# EAGLE design Mega_PCB (EAGLE 9.6.2)
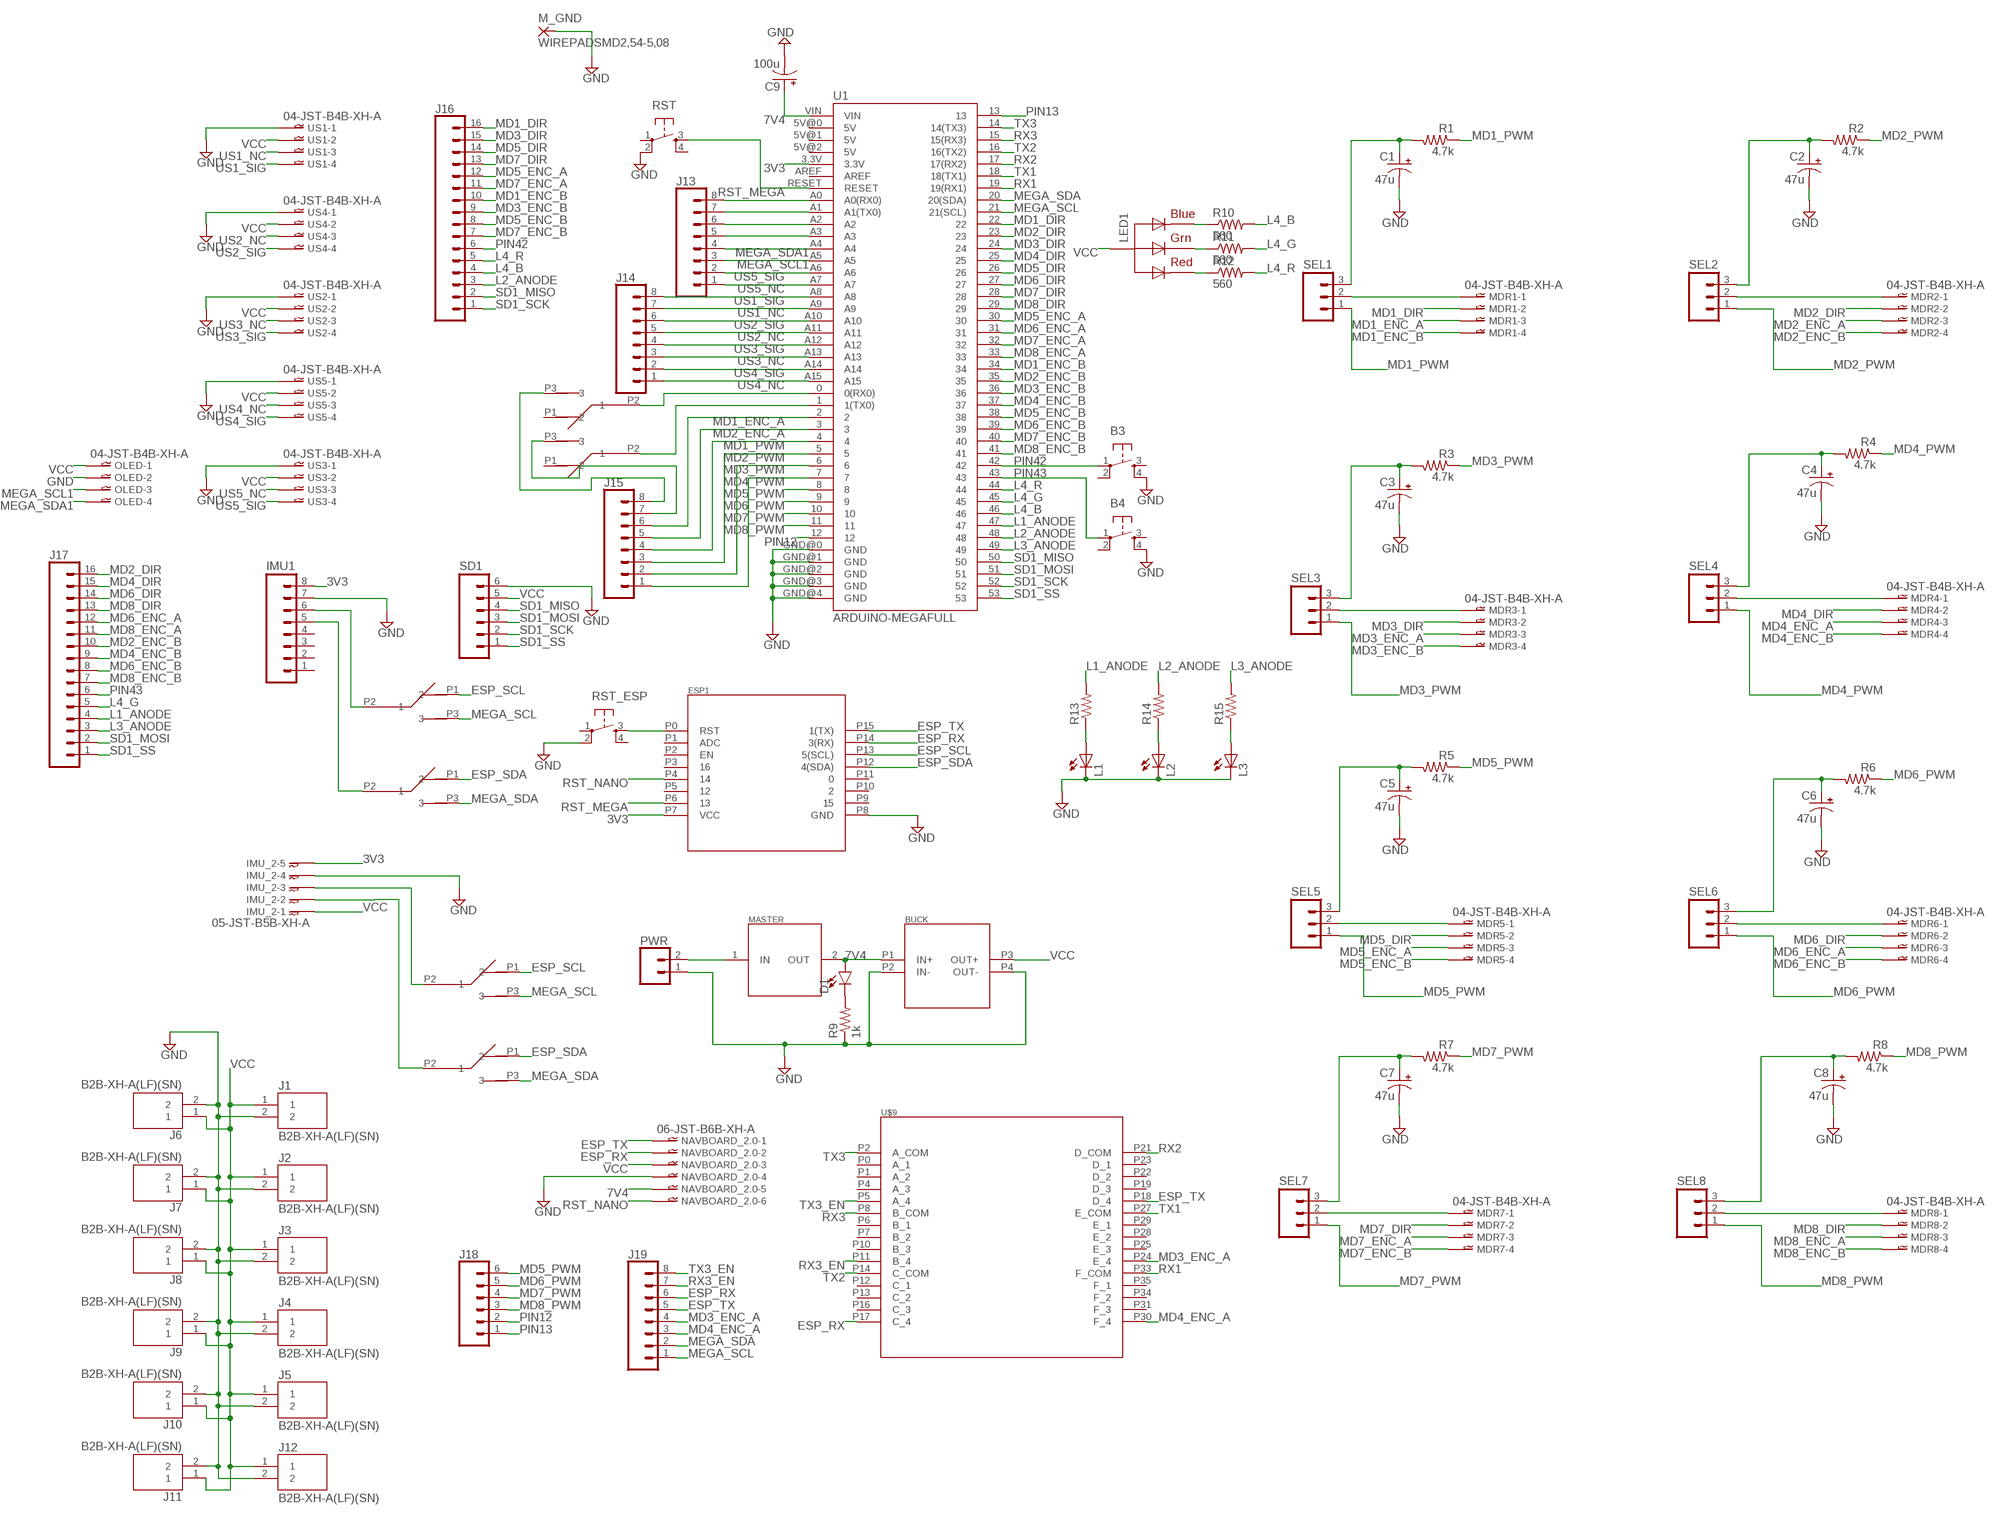
[diagram p0: schematic, sheet 1]

## Parts
B3  TAC_SWITCHPTH  [TACTILE-PTH]
B4  TAC_SWITCHPTH  [TACTILE-PTH]
BUCK  5V_BUCK  [5V_BUCK]
C1  47u  CPOL-USE2-5  [E2-5]
C2  47u  CPOL-USE2-5  [E2-5]
C3  47u  CPOL-USE2-5  [E2-5]
C4  47u  CPOL-USE2-5  [E2-5]
C5  47u  CPOL-USE2-5  [E2-5]
C6  47u  CPOL-USE2-5  [E2-5]
C7  47u  CPOL-USE2-5  [E2-5]
C8  47u  CPOL-USE2-5  [E2-5]
C9  100u  CPOL-USTT2D6  [TT2D6]
D1  LED5MM  [LED_5MM]
ESP1  ESP07  [ESP07]
IMU1  M081X08  [1X08]
IMU1_SCL_SEL  SLIDE_SWITCH  [SLIDE_SWITCH]
IMU1_SDA_SEL  SLIDE_SWITCH  [SLIDE_SWITCH]
IMU2_SCL_SEL  SLIDE_SWITCH  [SLIDE_SWITCH]
IMU2_SDA_SEL  SLIDE_SWITCH  [SLIDE_SWITCH]
IMU_2  05-JST-B5B-XH-A  [B5B-XH]
J1  B2B-XH-A(LF)(SN)  [JST_B2B-XH-A(LF)(SN)]
J2  B2B-XH-A(LF)(SN)  [JST_B2B-XH-A(LF)(SN)]
J3  B2B-XH-A(LF)(SN)  [JST_B2B-XH-A(LF)(SN)]
J4  B2B-XH-A(LF)(SN)  [JST_B2B-XH-A(LF)(SN)]
J5  B2B-XH-A(LF)(SN)  [JST_B2B-XH-A(LF)(SN)]
J6  B2B-XH-A(LF)(SN)  [JST_B2B-XH-A(LF)(SN)]
J7  B2B-XH-A(LF)(SN)  [JST_B2B-XH-A(LF)(SN)]
J8  B2B-XH-A(LF)(SN)  [JST_B2B-XH-A(LF)(SN)]
J9  B2B-XH-A(LF)(SN)  [JST_B2B-XH-A(LF)(SN)]
J10  B2B-XH-A(LF)(SN)  [JST_B2B-XH-A(LF)(SN)]
J11  B2B-XH-A(LF)(SN)  [JST_B2B-XH-A(LF)(SN)]
J12  B2B-XH-A(LF)(SN)  [JST_B2B-XH-A(LF)(SN)]
J13  CONN_08"  [1X08]
J14  CONN_08"  [1X08]
J15  CONN_08"  [1X08]
J16  CONN_16  [1X16]
J17  CONN_16  [1X16]
J18  CONN_06SILK_FEMALE_PTH  [1X06]
J19  CONN_08"  [1X08]
L1  LED3MM  [LED3MM]
L2  LED3MM  [LED3MM]
L3  LED3MM  [LED3MM]
LED1  RGBLED_CA-5MM  [LED5MMRGB]
M_GND  WIREPADSMD2,54-5,08  [SMD2,54-5,08]
MASTER  MED_SWITCH  [MED_SWITCH]
MDR1  04-JST-B4B-XH-A  [B4B-XH]
MDR2  04-JST-B4B-XH-A  [B4B-XH]
MDR3  04-JST-B4B-XH-A  [B4B-XH]
MDR4  04-JST-B4B-XH-A  [B4B-XH]
MDR5  04-JST-B4B-XH-A  [B4B-XH]
MDR6  04-JST-B4B-XH-A  [B4B-XH]
MDR7  04-JST-B4B-XH-A  [B4B-XH]
MDR8  04-JST-B4B-XH-A  [B4B-XH]
NAVBOARD_2.0  06-JST-B6B-XH-A  [B6B-XH]
OLED  04-JST-B4B-XH-A  [B4B-XH]
PWR  CONN_02PTH4  [1X02_XTRA_BIG]
R1  4.7k  R-US_0204/7  [0204/7]
R2  4.7k  R-US_0204/7  [0204/7]
R3  4.7k  R-US_0204/7  [0204/7]
R4  4.7k  R-US_0204/7  [0204/7]
R5  4.7k  R-US_0204/7  [0204/7]
R6  4.7k  R-US_0204/7  [0204/7]
R7  4.7k  R-US_0204/7  [0204/7]
R8  4.7k  R-US_0204/7  [0204/7]
R9  1k  R-US_0204/7  [0204/7]
R10  560  R-US_0204/7  [0204/7]
R11  560  R-US_0204/7  [0204/7]
R12  560  R-US_0204/7  [0204/7]
R13  R-US_0204/7  [0204/7]
R14  R-US_0204/7  [0204/7]
R15  R-US_0204/7  [0204/7]
RST  TAC_SWITCHPTH  [TACTILE-PTH]
RST_ESP  TAC_SWITCHPTH  [TACTILE-PTH]
SD1  M06SIP  [1X06]
SEL1  M03PTH  [1X03]
SEL2  M03PTH  [1X03]
SEL3  M03PTH  [1X03]
SEL4  M03PTH  [1X03]
SEL5  M03PTH  [1X03]
SEL6  M03PTH  [1X03]
SEL7  M03PTH  [1X03]
SEL8  M03PTH  [1X03]
U1  ARDUINO-MEGAFULL  [ARDUINO_MEGA]
U$3  SLIDE_SWITCH  [SLIDE_SWITCH]
U$4  SLIDE_SWITCH  [SLIDE_SWITCH]
U$9  CATERPILLAR  [CATERPILLAR]
US1  04-JST-B4B-XH-A  [B4B-XH]
US2  04-JST-B4B-XH-A  [B4B-XH]
US3  04-JST-B4B-XH-A  [B4B-XH]
US4  04-JST-B4B-XH-A  [B4B-XH]
US5  04-JST-B4B-XH-A  [B4B-XH]

## Nets
3V3: ESP1.P7(VCC) IMU1.8 IMU_2.P$5 U1.3.3V
7V4: BUCK.P1(IN+) C9.+ D1.A MASTER.2(OUT) NAVBOARD_2.0.P$5 U1.VIN
ESP_RX: ESP1.P14(3(RX)) J19.6 NAVBOARD_2.0.P$2 U$9.P17(C_4)
ESP_SCL: ESP1.P13(5(SCL)) IMU1_SCL_SEL.P1 IMU2_SCL_SEL.P1
ESP_SDA: ESP1.P12(4(SDA)) IMU1_SDA_SEL.P1 IMU2_SDA_SEL.P1
ESP_TX: ESP1.P15(1(TX)) J19.5 NAVBOARD_2.0.P$1 U$9.P18(D_4)
GND: B3.4 B4.4 BUCK.P2(IN-) BUCK.P4(OUT-) C1.- C2.- C3.- C4.- C5.- C6.- C7.- C8.- C9.- ESP1.P8(GND) IMU1.7 IMU_2.P$4 J1.2 J2.2 J3.2 J4.2 J5.2 J6.2 J7.2 J8.2 J9.2 J10.2 J11.2 J12.2 L1.K(C) L2.K(C) L3.K(C) M_GND.1(P) NAVBOARD_2.0.P$4 OLED.P$2 PWR.1 R9.1 RST.2 RST_ESP.2 SD1.6 U1.GND@0(GND) U1.GND@1(GND) U1.GND@2(GND) U1.GND@3(GND) U1.GND@4(GND) US1.P$1 US2.P$1 US3.P$1 US4.P$1 US5.P$1
IMU_SDA: IMU1.5 IMU1_SDA_SEL.P2
IMU_SDA1: IMU2_SDA_SEL.P2 IMU_2.P$2
L1_ANODE: J17.4 R13.2 U1.47
L2_ANODE: J16.3 R14.2 U1.48
L3_ANODE: J17.3 R15.2 U1.49
L4_B: J16.4 R10.2 U1.46
L4_G: J17.5 R11.2 U1.45
L4_R: J16.5 R12.2 U1.44
MD1_DIR: J16.16 MDR1.P$2 U1.22
MD1_ENC_A: J15.6 MDR1.P$3 U1.2
MD1_ENC_B: J16.10 MDR1.P$4 U1.34
MD1_PWM: J15.4 R1.1 SEL1.1 U1.4
MD2_DIR: J17.16 MDR2.P$2 U1.23
MD2_ENC_A: J15.5 MDR2.P$3 U1.3
MD2_ENC_B: J17.10 MDR2.P$4 U1.35
MD2_PWM: J15.3 R2.1 SEL2.1 U1.5
MD3_DIR: J16.15 MDR3.P$2 U1.24
MD3_ENC_A: J19.4 MDR3.P$3 U$9.P24(E_4)
MD3_ENC_B: J16.9 MDR3.P$4 U1.36
MD3_PWM: J15.2 R3.1 SEL3.1 U1.6
MD4_DIR: J17.15 MDR4.P$2 U1.25
MD4_ENC_A: J19.3 MDR4.P$3 U$9.P30(F_4)
MD4_ENC_B: J17.9 MDR4.P$4 U1.37
MD4_PWM: J15.1 R4.1 SEL4.1 U1.7
MD5_DIR: J16.14 MDR5.P$2 U1.26
MD5_ENC_A: J16.12 MDR5.P$3 U1.30
MD5_ENC_B: J16.8 MDR5.P$4 U1.38
MD5_PWM: J18.6 R5.1 SEL5.1 U1.8
MD6_DIR: J17.14 MDR6.P$2 U1.27
MD6_ENC_A: J17.12 MDR6.P$3 U1.31
MD6_ENC_B: J17.8 MDR6.P$4 U1.39
MD6_PWM: J18.5 R6.1 SEL6.1 U1.9
MD7_DIR: J16.13 MDR7.P$2 U1.28
MD7_ENC_A: J16.11 MDR7.P$3 U1.32
MD7_ENC_B: J16.7 MDR7.P$4 U1.40
MD7_PWM: J18.4 R7.1 SEL7.1 U1.10
MD8_DIR: J17.13 MDR8.P$2 U1.29
MD8_ENC_A: J17.11 MDR8.P$3 U1.33
MD8_ENC_B: J17.7 MDR8.P$4 U1.41
MD8_PWM: J18.3 R8.1 SEL8.1 U1.11
MEGA_SCL: IMU1_SCL_SEL.P3 IMU2_SCL_SEL.P3 J19.1 U1.21(21(SCL))
MEGA_SCL1: J13.3 OLED.P$3 U1.A5
MEGA_SDA: IMU1_SDA_SEL.P3 IMU2_SDA_SEL.P3 J19.2 U1.20(20(SDA))
MEGA_SDA1: J13.4 OLED.P$4 U1.A4
N$0: MDR2.P$1 SEL2.2
N$1: C2.+ R2.2 SEL2.3
N$2: MDR3.P$1 SEL3.2
N$3: MDR1.P$1 SEL1.2
N$4: C3.+ R3.2 SEL3.3
N$5: C4.+ R4.2 SEL4.3
N$6: C8.+ R8.2 SEL8.3
N$7: C6.+ R6.2 SEL6.3
N$8: MDR4.P$1 SEL4.2
N$9: MDR8.P$1 SEL8.2
N$10: C5.+ R5.2 SEL5.3
N$11: IMU1.6 IMU1_SCL_SEL.P2
N$12: D1.K(C) R9.2
N$13: LED1.4(BLUE) R10.1
N$14: J13.8 U1.A0(A0(RX0))
N$15: C1.+ R1.2 SEL1.3
N$16: MDR5.P$1 SEL5.2
N$17: MDR6.P$1 SEL6.2
N$18: U1.0(0(RX0)) U$3.P2
N$19: U1.1(1(TX0)) U$4.P2
N$20: IMU2_SCL_SEL.P2 IMU_2.P$3
N$21: C7.+ R7.2 SEL7.3
N$22: MDR7.P$1 SEL7.2
N$23: J13.7 U1.A1(A1(TX0))
N$24: ESP1.P0(RST) RST_ESP.3
N$25: J13.6 U1.A2
N$26: J13.5 U1.A3
N$29: J15.8 U$3.P3
N$30: J15.7 U$4.P3
N$31: LED1.3(GREEN) R11.1
N$32: LED1.1(RED) R12.1
N$36: L1.A R13.1
N$37: L2.A R14.1
N$38: L3.A R15.1
N&N: MASTER.1(IN) PWR.2
PIN12: J18.2 U1.12
PIN13: J18.1 U1.13
PIN42: B3.1 J16.6 U1.42
PIN43: B4.1 J17.6 U1.43
RST_MEGA: ESP1.P6 RST.3 U1.RESET
RST_NANO: ESP1.P4 NAVBOARD_2.0.P$6
RX1: U1.19(19(RX1)) U$9.P33(F_COM)
RX2: U1.17(17(RX2)) U$9.P21(D_COM)
RX3: U1.15(15(RX3)) U$9.P8(B_COM)
RX3_EN: J19.7 U$9.P11(B_4)
SD1_MISO: J16.2 SD1.4 U1.50
SD1_MOSI: J17.2 SD1.3 U1.51
SD1_SCK: J16.1 SD1.2 U1.52
SD1_SS: J17.1 SD1.1 U1.53
TX1: U1.18(18(TX1)) U$9.P27(E_COM)
TX2: U1.16(16(TX2)) U$9.P14(C_COM)
TX3: U1.14(14(TX3)) U$9.P2(A_COM)
TX3_EN: J19.8 U$9.P5(A_4)
US1_NC: J14.7 U1.A9 US1.P$3
US1_SIG: J14.8 U1.A8 US1.P$4
US2_NC: J14.5 U1.A11 US4.P$3
US2_SIG: J14.6 U1.A10 US4.P$4
US3_NC: J14.3 U1.A13 US2.P$3
US3_SIG: J14.4 U1.A12 US2.P$4
US4_NC: J14.1 U1.A15 US5.P$3
US4_SIG: J14.2 U1.A14 US5.P$4
US5_NC: J13.1 U1.A7 US3.P$3
US5_SIG: J13.2 U1.A6 US3.P$4
VCC: BUCK.P3(OUT+) IMU_2.P$1 J1.1 J2.1 J3.1 J4.1 J5.1 J6.1 J7.1 J8.1 J9.1 J10.1 J11.1 J12.1 LED1.2(VCC) NAVBOARD_2.0.P$3 OLED.P$1 SD1.5 US1.P$2 US2.P$2 US3.P$2 US4.P$2 US5.P$2
Unconnected: B3.2 B3.3 B4.2 B4.3 ESP1.P1(ADC) ESP1.P2(EN) ESP1.P3 ESP1.P5 ESP1.P9 ESP1.P10 ESP1.P11 IMU1.1 IMU1.2 IMU1.3 IMU1.4 RST.1 RST.4 RST_ESP.1 RST_ESP.4 U1.5V@0(5V) U1.5V@1(5V) U1.5V@2(5V) U1.AREF U$3.P1 U$4.P1 U$9.P0(A_1) U$9.P1(A_2) U$9.P4(A_3) U$9.P6(B_1) U$9.P7(B_2) U$9.P10(B_3) U$9.P12(C_1) U$9.P13(C_2) U$9.P16(C_3) U$9.P19(D_3) U$9.P22(D_2) U$9.P23(D_1) U$9.P25(E_3) U$9.P28(E_2) U$9.P29(E_1) U$9.P31(F_3) U$9.P34(F_2) U$9.P35(F_1)

## Library data of the parts
B3 B4 RST RST_ESP = SparkFun:TAC_SWITCH: Momentary Switch Button commonly used for reset or general input. Spark Fun Electronics SKU : COM-00097
BUCK = Robocon:5V_BUCK
C1-C9 = adafruit:CPOL-US: POLARIZED CAPACITOR, American symbol
D1 = SparkFun-LED:LED: LED (Generic) Standard schematic elements and footprints for 5mm, 3mm, 1206, and 0603 sized LEDs. Generic LEDs with no color specified.
ESP1 = Robocon:ESP07
IMU1 = SparkFun:M08: Header 8 Standard 8-pin 0.1" header. Use with straight break away headers (SKU : PRT-00116), right angle break away headers (PRT-00553), swiss pins (PRT-00743), machine pins (PRT-00117), and female headers (PRT-00115).
IMU1_SCL_SEL IMU1_SDA_SEL IMU2_SCL_SEL IMU2_SDA_SEL U$3 U$4 = Robocon:SLIDE_SWITCH
IMU_2 = bt_con-jst-xh:05-JST: JST CONNECTOR
J1-J12 = B2B-XH-A_LF__SN_:B2B-XH-A(LF)(SN): Connector Header Through Hole 2 position 0.098" (2.50mm) Check prices <https://pricing.snapeda.com/parts/B2B-XH-A%28LF%29%28SN%29/JST%20Sales/view-part?ref=eda> Check availability <https://pricing.snapeda.com/parts/B2B-XH-A%28LF%29%28SN%29/JST%20Sales/view-part?ref=eda>; AVAILABILITY: In Stock; DESCRIPTION: Connector Header Through Hole 2 position 0.098 (2.50mm); MF: JST Sales; MP: B2B-XH-A(LF)(SN); PACKAGE: None; PRICE: None; PURCHASE-URL: https://pricing.snapeda.com/search/part/B2B-XH-A(LF)(SN)/?ref=eda
J13-J15 J19 = SparkFun-Connectors:CONN_08: Multi connection point. Often used as Generic Header-pin footprint for 0.1 inch spaced/style header connections On any of the 0.1 inch spaced packages, you can populate with these: Break Away Headers - Straight <https://www.sparkfun.com/products/116> (PRT-00116) Break Away Male Headers - Right Angle <https://www.sparkfun.com/products/553> (PRT-00553) Female Headers <https://www.sparkfun.com/products/115> (PRT-00115) Break Away Headers - Machine Pin <https://www.sparkfun.com/products/117> (PRT-00117) Break Away Female Headers - Swiss Machine Pin <https://www.sparkfun.com/products/743> (PRT-00743) Arduino Stackable Header - 8 Pin <https://www.sparkfun.com/products/9279> (PRT-09279) For SCREWTERMINALS and SPRING TERMINALS visit here: Screw Terimnals on SparkFun.com <https://www.sparkfun.com/search/results?term=Screw+Terminals> (5mm/3.5mm/2.54mm spacing) This device is also useful as a general connection point to wire up your design to another part of your project. Our various solder wires solder well into these plated through hole pads. Hook-Up Wire - Assortment (Stranded, 22 AWG) <https://www.sparkfun.com/products/11375> (PRT-11375) Hook-Up Wire - Assortment (Solid Core, 22 AWG) <https://www.sparkfun.com/products/11367> (PRT-11367) View the entire wire category on our website here <https://www.sparkfun.com/categories/141> Special notes: Molex polarized connector foot print use with SKU : PRT-08231 with associated crimp pins and housings. 1MM SMD Version SKU: PRT-10208 NOTES ON THE VARIANTS LOCK and LOCK_LONGPADS... This footprint was designed to help hold the alignment of a through-hole component (i.e. 6-pin header) while soldering it into place. You may notice that each hole has been shifted either up or down by 0.005 of an inch from it's more standard position (which is a perfectly straight line). This slight alteration caused the pins (the squares in the middle) to touch the edges of the holes. Because they are alternating, it causes a "brace" to hold the component in place. 0.005 has proven to be the perfect amount of "off-center" position when using our standard breakaway headers. Although looks a little odd when you look at the bare footprint, once you have a header in there, the alteration is very hard to notice. Also,if you push a header all the way into place, it is covered up entirely on the bottom side.; PROD_ID: CONN-08438
J16 J17 = SparkFun-Connectors:CONN_16: Multi connection point. Often used as Generic Header-pin footprint for 0.1 inch spaced/style header connections On any of the 0.1 inch spaced packages, you can populate with these: Break Away Headers - Straight <https://www.sparkfun.com/products/116> (PRT-00116) Break Away Male Headers - Right Angle <https://www.sparkfun.com/products/553> (PRT-00553) Female Headers <https://www.sparkfun.com/products/115> (PRT-00115) Break Away Headers - Machine Pin <https://www.sparkfun.com/products/117> (PRT-00117) Break Away Female Headers - Swiss Machine Pin <https://www.sparkfun.com/products/743> (PRT-00743) For SCREWTERMINALS and SPRING TERMINALS visit here: Screw Terimnals on SparkFun.com <https://www.sparkfun.com/search/results?term=Screw+Terminals> (5mm/3.5mm/2.54mm spacing) This device is also useful as a general connection point to wire up your design to another part of your project. Our various solder wires solder well into these plated through hole pads. Hook-Up Wire - Assortment (Stranded, 22 AWG) <https://www.sparkfun.com/products/11375> (PRT-11375) Hook-Up Wire - Assortment (Solid Core, 22 AWG) <https://www.sparkfun.com/products/11367> (PRT-11367) View the entire wire category on our website here <https://www.sparkfun.com/categories/141> Special notes: Molex polarized connector foot print use with SKU : PRT-08231 with associated crimp pins and housings. 1MM SMD Version SKU: PRT-10208 NOTES ON THE VARIANTS LOCK and LOCK_LONGPADS... This footprint was designed to help hold the alignment of a through-hole component (i.e. 6-pin header) while soldering it into place. You may notice that each hole has been shifted either up or down by 0.005 of an inch from it's more standard position (which is a perfectly straight line). This slight alteration caused the pins (the squares in the middle) to touch the edges of the holes. Because they are alternating, it causes a "brace" to hold the component in place. 0.005 has proven to be the perfect amount of "off-center" position when using our standard breakaway headers. Although looks a little odd when you look at the bare footprint, once you have a header in there, the alteration is very hard to notice. Also,if you push a header all the way into place, it is covered up entirely on the bottom side.
J18 = SparkFun-Connectors:CONN_06: Multi connection point. Often used as Generic Header-pin footprint for 0.1 inch spaced/style header connections On any of the 0.1 inch spaced packages, you can populate with these: Break Away Headers - Straight <https://www.sparkfun.com/products/116> (PRT-00116) Break Away Male Headers - Right Angle <https://www.sparkfun.com/products/553> (PRT-00553) Female Headers <https://www.sparkfun.com/products/115> (PRT-00115) Break Away Headers - Machine Pin <https://www.sparkfun.com/products/117> (PRT-00117) Break Away Female Headers - Swiss Machine Pin <https://www.sparkfun.com/products/743> (PRT-00743) Arduino Stackable Header - 6 Pin <https://www.sparkfun.com/products/9280> (PRT-09280) For SCREWTERMINALS and SPRING TERMINALS visit here: Screw Terimnals on SparkFun.com <https://www.sparkfun.com/search/results?term=Screw+Terminals> (5mm/3.5mm/2.54mm spacing) This device is also useful as a general connection point to wire up your design to another part of your project. Our various solder wires solder well into these plated through hole pads. Hook-Up Wire - Assortment (Stranded, 22 AWG) <https://www.sparkfun.com/products/11375> (PRT-11375) Hook-Up Wire - Assortment (Solid Core, 22 AWG) <https://www.sparkfun.com/products/11367> (PRT-11367) View the entire wire category on our website here <https://www.sparkfun.com/categories/141>; PROD_ID: CONN-08437
L1-L3 = adafruit:LED: LED OSRAM: - CHIPLED LG R971, LG N971, LY N971, LG Q971, LY Q971, LO R971, LY R971 LH N974, LH R974 LS Q976, LO Q976, LY Q976 LO Q996 - Hyper CHIPLED LW Q18S LB Q993, LB Q99A, LB R99A - SideLED LS A670, LO A670, LY A670, LG A670, LP A670 LB A673, LV A673, LT A673, LW A673 LH A674 LY A675 LS A676, LA A676, LO A676, LY A676, LW A676 LS A679, LY A679, LG A679 - Hyper Micro SIDELED® LS Y876, LA Y876, LO Y876, LY Y876 LT Y87S - SmartLED LW L88C, LW L88S LB L89C, LB L89S, LG L890 LS L89K, LO L89K, LY L89K LS L896, LA L896, LO L896, LY L896 - TOPLED LS T670, LO T670, LY T670, LG T670, LP T670 LSG T670, LSP T670, LSY T670, LOP T670, LYG T670 LG T671, LOG T671, LSG T671 LB T673, LV T673, LT T673, LW T673 LH T674 LS T676, LA T676, LO T676, LY T676, LB T676, LH T676, LSB T676, LW T676 LB T67C, LV T67C, LT T67C, LS T67K, LO T67K, LY T67K, LW E67C LS E67B, LA E67B, LO E67B, LY E67B, LB E67C, LV E67C, LT E67C LW T67C LS T679, LY T679, LG T679 LS T770, LO T770, LY T770, LG T770, LP T770 LB T773, LV T773, LT T773, LW T773 LH T774 LS E675, LA E675, LY E675, LS T675 LS T776, LA T776, LO T776, LY T776, LB T776 LHGB T686 LT T68C, LB T68C - Hyper Mini TOPLED® LB M676 - Mini TOPLED Santana® LG M470 LS M47K, LO M47K, LY M47K Source: http://www.osram.convergy.de/
LED1 = adafruit:RGBLED_CA: RGB LED, common-anode 5MM Staggered pins 5mm Piranha package http://www.ladyada.net/library/pcb/eaglelibrary.html
M_GND = wirepad:WIREPAD: Wire PAD connect wire on PCB
MASTER = Robocon:MED_SWITCH
MDR1-MDR8 OLED US1-US5 = bt_con-jst-xh:04-JST: JST CONNECTOR
NAVBOARD_2.0 = bt_con-jst-xh:06-JST: JST CONNECTOR
PWR = SparkFun-Connectors:CONN_02: Multi connection point. Often used as Generic Header-pin footprint for 0.1 inch spaced/style header connections On any of the 0.1 inch spaced packages, you can populate with these: Break Away Headers - Straight <https://www.sparkfun.com/products/116> (PRT-00116) Break Away Male Headers - Right Angle <https://www.sparkfun.com/products/553> (PRT-00553) Female Headers <https://www.sparkfun.com/products/115> (PRT-00115) Break Away Headers - Machine Pin <https://www.sparkfun.com/products/117> (PRT-00117) Break Away Female Headers - Swiss Machine Pin <https://www.sparkfun.com/products/743> (PRT-00743) For SCREWTERMINALS and SPRING TERMINALS visit here: Screw Terimnals on SparkFun.com <https://www.sparkfun.com/search/results?term=Screw+Terminals> (5mm/3.5mm/2.54mm spacing) This device is also useful as a general connection point to wire up your design to another part of your project. Our various solder wires solder well into these plated through hole pads. Hook-Up Wire - Assortment (Stranded, 22 AWG) <https://www.sparkfun.com/products/11375> (PRT-11375) Hook-Up Wire - Assortment (Solid Core, 22 AWG) <https://www.sparkfun.com/products/11367> (PRT-11367) View the entire wire category on our website here <https://www.sparkfun.com/categories/141> Special notes: Molex polarized connector foot print use with: PRT-08233 with associated crimp pins and housings. 2.54_SCREWTERM for use with PRT-10571. 3.5mm Screw Terminal footprints for PRT-08084 5mm Screw Terminal footprints for use with PRT-08432
R1-R15 = adafruit:R-US_: RESISTOR, American symbol
SD1 = SparkFun:M06: Header 6 Standard 6-pin 0.1" header. Use with straight break away headers (SKU : PRT-00116), right angle break away headers (PRT-00553), swiss pins (PRT-00743), machine pins (PRT-00117), and female headers (PRT-00115). Molex polarized connector foot print use with SKU : PRT-08094 with associated crimp pins and housings. NOTES ON THE VARIANTS LOCK and LOCK_LONGPADS... This footprint was designed to help hold the alignment of a through-hole component (i.e. 6-pin header) while soldering it into place. You may notice that each hole has been shifted either up or down by 0.005 of an inch from it's more standard position (which is a perfectly straight line). This slight alteration caused the pins (the squares in the middle) to touch the edges of the holes. Because they are alternating, it causes a "brace" to hold the component in place. 0.005 has proven to be the perfect amount of "off-center" position when using our standard breakaway headers. Although looks a little odd when you look at the bare footprint, once you have a header in there, the alteration is very hard to notice. Also, if you push a header all the way into place, it is covered up entirely on the bottom side. This idea of altering the position of holes to aid alignment will be further integrated into the Sparkfun Library for other footprints. It can help hold any component with 3 or more connection pins.
SEL1-SEL8 = SparkFun:M03: Header 3 Standard 3-pin 0.1" header. Use with straight break away headers (SKU : PRT-00116), right angle break away headers (PRT-00553), swiss pins (PRT-00743), machine pins (PRT-00117), and female headers (PRT-00115). Molex polarized connector foot print use with SKU : PRT-08232 with associated crimp pins and housings.
U1 = SparkFun:ARDUINO-MEGA: Arduino Mega footprint connections
U$9 = Robocon:CATERPILLAR

## Board
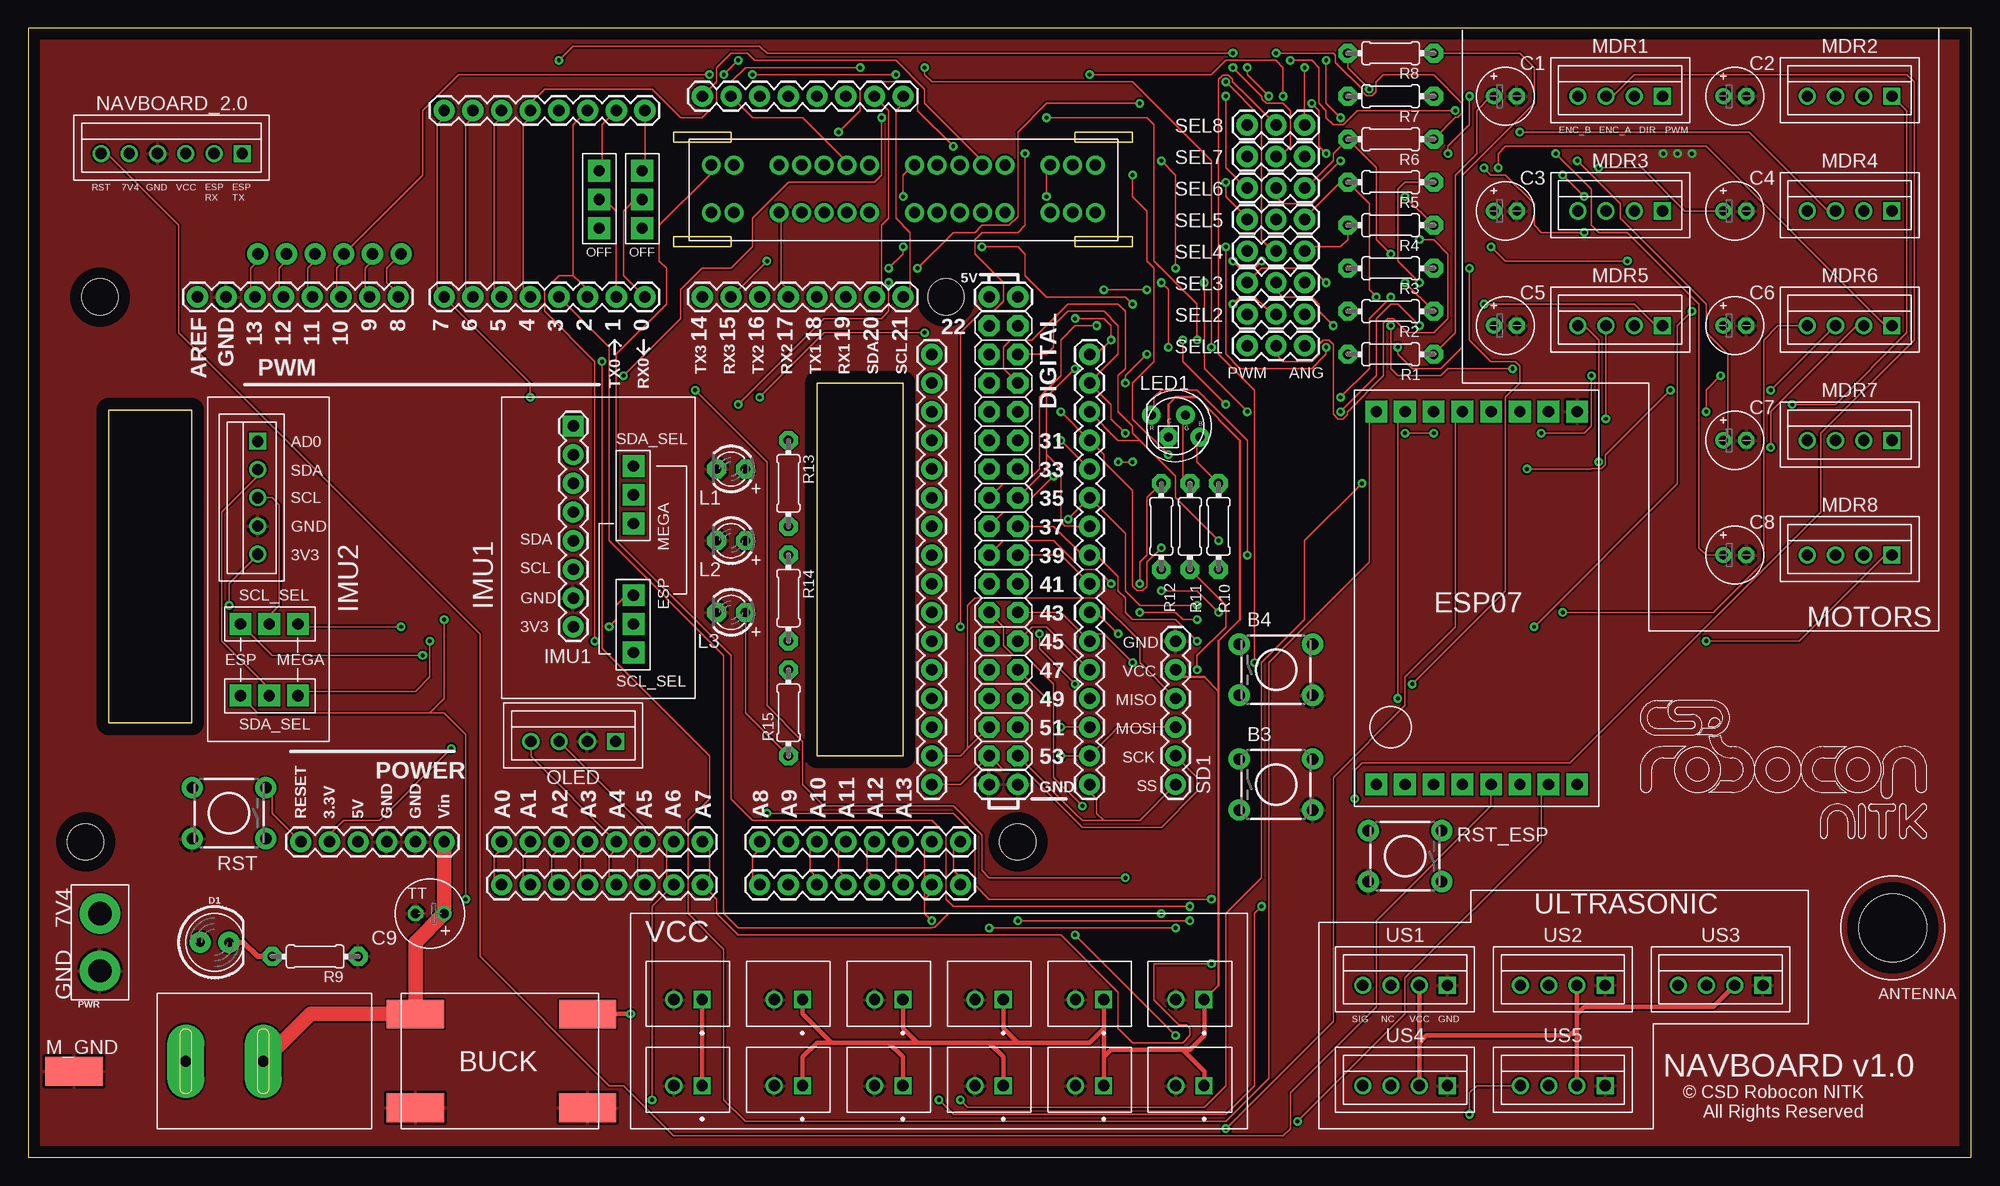
[diagram p1: board, top side]
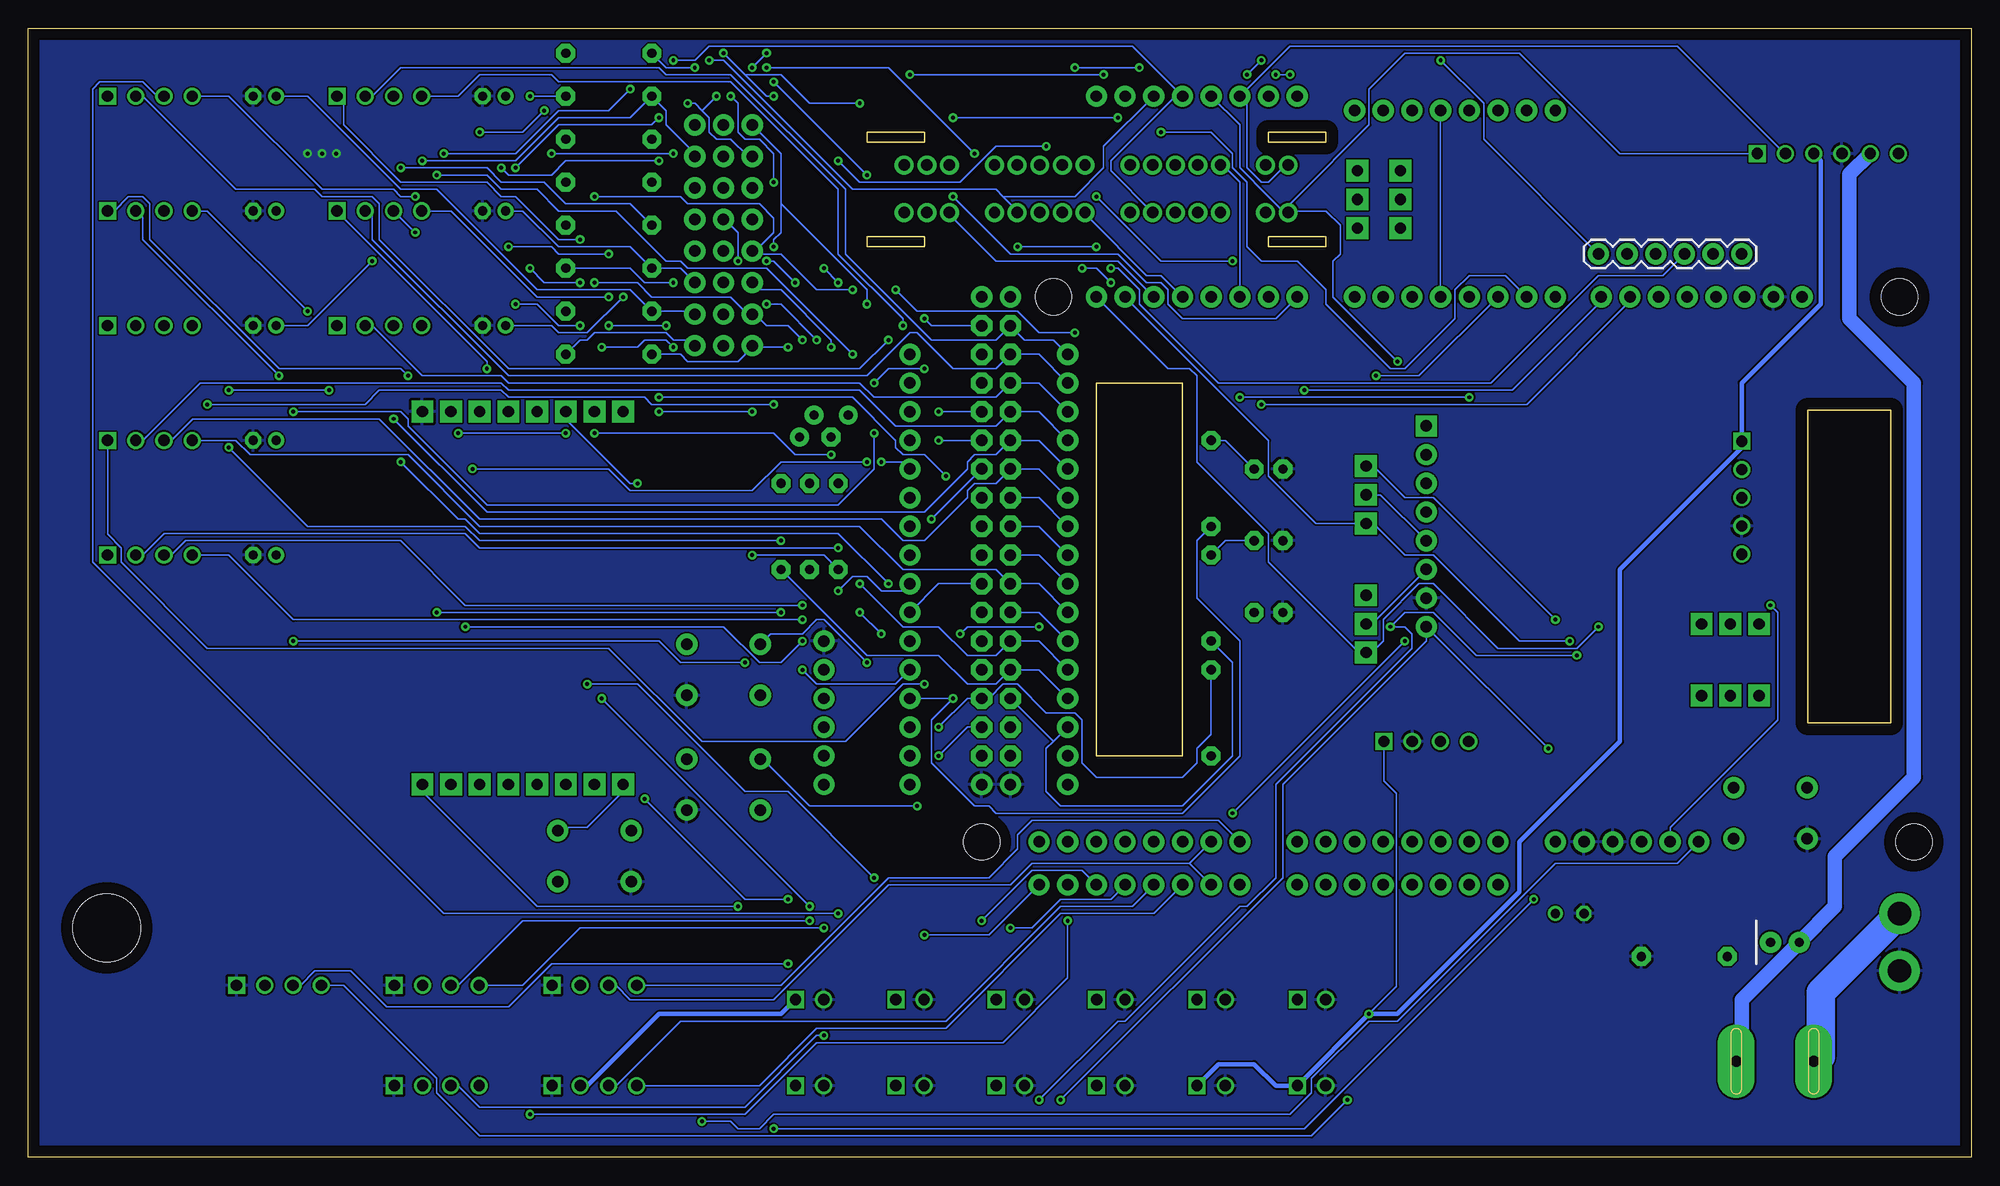
[diagram p2: board, bottom side, seen from below]

Size 172.06 x 100 mm. Coordinates in mm from the lower left corner, seen from the top.
Copper layers (1*16): Top 0.035mm / dielectric 1.5mm / Bottom 0.035mm
Design rules "default": minimum track width 6mil, minimum drill 0.35mm, track to track 6mil, track to pad 6mil, pad to pad 6mil, via to via 6mil, smd to smd 6mil, copper to edge 40mil, drill to drill 6mil, minimum pad ring 10mil, minimum via ring 8mil, stop-mask expansion 4mil, vias tented up to drill 0mil, thermal gap 10mil
Holes 6 mm at 165.1,20.32

### Footprints (pad centres in the part's own frame; a part is rotated, then mirrored left to right if it is on the bottom)
TACTILE-PTH = drill 1.016 pad 1.88: 1 -3.251,2.261; 2 3.251,2.261; 3 -3.251,-2.261; 4 3.251,-2.261
5V_BUCK = smd 5.08 x 2.54: P1 1.27,10.16; P2 1.27,1.84; P3 16.51,10.16; P4 16.51,1.84
E2-5 = drill 0.813 pad 1.422: + -1.016,0 | drill 0.813 pad 1.422 octagon: - 1.016,0
TT2D6 = drill 0.813: + -1.27,0 | drill 0.813 octagon: - 1.27,0
LED_5MM = drill 0.813 pad 1.88: A -1.27,0; K 1.27,0
ESP07 = drill 1 pad 1.93 square: P0 -16.51,8.89; P1 -16.51,6.35; P2 -16.51,3.81; P3 -16.51,1.27; P4 -16.51,-1.27; P5 -16.51,-3.81; P6 -16.51,-6.35; P7 -16.51,-8.89; P8 16.51,-8.89; P9 16.51,-6.35; P10 16.51,-3.81; P11 16.51,-1.27; P12 16.51,1.27; P13 16.51,3.81; P14 16.51,6.35; P15 16.51,8.89
1X08 = drill 1.016 pad 1.88 square: 1 0,0 | drill 1.016 pad 1.88: 2 2.54,0; 3 5.08,0; 4 7.62,0; 5 10.16,0; 6 12.7,0; 7 15.24,0; 8 17.78,0
SLIDE_SWITCH = drill 1 pad 1.93 square: P1 1.524,6.604; P2 1.524,4.064; P3 1.524,1.524
B5B-XH = drill 1 square: P$1 5,0 | drill 1: P$2 2.5,0; P$3 0,0; P$4 -2.5,0; P$5 -5,0
JST_B2B-XH-A(LF)(SN) = drill 1 square: 1 1.25,0 | drill 1: 2 -1.25,0
1X08' = drill 1.016 pad 1.88: 1 0,0; 2 2.54,0; 3 5.08,0; 4 7.62,0; 5 10.16,0; 6 12.7,0; 7 15.24,0; 8 17.78,0
1X16 = drill 1.016 pad 1.88: 1 0,0; 2 2.54,0; 3 5.08,0; 4 7.62,0; 5 10.16,0; 6 12.7,0; 7 15.24,0; 8 17.78,0; 9 20.32,0; 10 22.86,0; 11 25.4,0; 12 27.94,0; 13 30.48,0; 14 33.02,0; 15 35.56,0; 16 38.1,0
1X06 = drill 1.016 pad 1.88: 1 0,0; 2 2.54,0; 3 5.08,0; 4 7.62,0; 5 10.16,0; 6 12.7,0
LED3MM = drill 0.813 pad 1.676 octagon: A -1.27,0; K 1.27,0
LED5MMRGB = drill 0.8 pad 1.676: 1 -2.159,0.968; 3 0.889,0.968; 4 2.159,-0.968 | drill 0.8 pad 1.676 octagon: 2 -0.635,-0.968
SMD2,54-5,08 = smd 2.54 x 5.08: 1 0,0
MED_SWITCH = drill 0.98 pad 3.26 long: 1 2.525,5.969; 2 9.383,5.969
B4B-XH = drill 1 square: P$1 3.75,0 | drill 1: P$2 1.25,0; P$3 -1.25,0; P$4 -3.75,0
B6B-XH = drill 1 square: P$1 6.25,0 | drill 1: P$2 3.75,0; P$3 1.25,0; P$4 -1.25,0; P$5 -3.75,0; P$6 -6.25,0
1X02_XTRA_BIG = drill 2.057 pad 3.556: 1 -2.54,0; 2 2.54,0
0204/7 = drill 0.813 pad 1.676 octagon: 1 -3.81,0; 2 3.81,0
1X03 = drill 1.016 pad 1.88: 1 0,0; 2 2.54,0; 3 5.08,0
ARDUINO_MEGA = drill 1.016 pad 1.88: 0 54.61,76.2; 1 52.07,76.2; 2 49.53,76.2; 3 46.99,76.2; 3.3V 26.67,27.94; 4 44.45,76.2; 5 41.91,76.2; 5V@0 29.21,27.94; 5V@1 85.09,76.2; 5V@2 87.63,76.2; 6 39.37,76.2; 7 36.83,76.2; 8 32.766,76.2; 9 30.226,76.2; 10 27.686,76.2; 11 25.146,76.2; 12 22.606,76.2; 13 20.066,76.2; 14 59.69,76.2; 15 62.23,76.2; 16 64.77,76.2; 17 67.31,76.2; 18 69.85,76.2; 19 72.39,76.2; 20 74.93,76.2; 21 77.47,76.2; A0 41.91,27.94; A1 44.45,27.94; A2 46.99,27.94; A3 49.53,27.94; A4 52.07,27.94; A5 54.61,27.94; A6 57.15,27.94; A7 59.69,27.94; A8 64.77,27.94; A9 67.31,27.94; A10 69.85,27.94; A11 72.39,27.94; A12 74.93,27.94; A13 77.47,27.94; A14 80.01,27.94; A15 82.55,27.94; AREF 14.986,76.2; GND@0 31.75,27.94; GND@1 34.29,27.94; GND@2 85.09,33.02; GND@3 87.63,33.02; GND@4 17.526,76.2; RESET 24.13,27.94; VIN 36.83,27.94 | drill 1.016 pad 1.88 octagon: 22 85.09,73.66; 23 87.63,73.66; 24 85.09,71.12; 25 87.63,71.12; 26 85.09,68.58; 27 87.63,68.58; 28 85.09,66.04; 29 87.63,66.04; 30 85.09,63.5; 31 87.63,63.5; 32 85.09,60.96; 33 87.63,60.96; 34 85.09,58.42; 35 87.63,58.42; 36 85.09,55.88; 37 87.63,55.88; 38 85.09,53.34; 39 87.63,53.34; 40 85.09,50.8; 41 87.63,50.8; 42 85.09,48.26; 43 87.63,48.26; 44 85.09,45.72; 45 87.63,45.72; 46 85.09,43.18; 47 87.63,43.18; 48 85.09,40.64; 49 87.63,40.64; 50 85.09,38.1; 51 87.63,38.1; 52 85.09,35.56; 53 87.63,35.56 | hole 3.2: 6.35,76.2; 5.08,27.94; 81.28,76.2; 87.63,27.94
CATERPILLAR = drill 1 pad 1.676: P0 2.032,2.286; P1 4.032,2.286; P2 6.032,2.286; P4 10.032,2.286; P5 12.032,2.286; P6 14.032,2.286; P7 16.032,2.286; P8 18.032,2.286; P10 22.032,2.286; P11 24.032,2.286; P12 26.032,2.286; P13 28.032,2.286; P14 30.032,2.286; P16 34.032,2.286; P17 36.032,2.286; P18 36.032,6.486; P19 34.032,6.486; P21 30.032,6.486; P22 28.032,6.486; P23 26.032,6.486; P24 24.032,6.486; P25 22.032,6.486; P27 18.032,6.486; P28 16.032,6.486; P29 14.032,6.486; P30 12.032,6.486; P31 10.032,6.486; P33 6.032,6.486; P34 4.032,6.486; P35 2.032,6.486

### Placement (x,y rotation side)
B3  110.49,33.02 0 top
B4  110.49,43.18 0 top
BUCK  33.02,2.54 0 top
C1  130.81,93.98 0 top
C2  151.13,93.98 0 top
C3  130.81,83.82 0 top
C4  151.13,83.82 0 top
C5  130.81,73.66 0 top
C6  151.13,73.66 0 top
C7  151.13,63.5 0 top
C8  151.13,53.34 0 top
C9  35.56,21.59 180 top
D1  16.51,19.05 0 top
ESP1  128.27,49.53 90 top
IMU1  48.26,64.77 270 top
IMU1_SCL_SEL  52.07,43.18 0 top
IMU1_SDA_SEL  52.07,54.61 0 top
IMU2_SCL_SEL  25.4,45.72 90 top
IMU2_SDA_SEL  25.4,39.37 90 top
IMU_2  20.32,58.42 90 top
J1  93.98,13.97 0 top
J2  85.09,6.35 0 top
J3  85.09,13.97 0 top
J4  76.2,6.35 0 top
J5  76.2,13.97 0 top
J6  67.31,6.35 0 top
J7  67.31,13.97 0 top
J8  58.42,6.35 0 top
J9  58.42,13.97 0 top
J10  102.87,6.35 0 top
J11  102.87,13.97 0 top
J12  93.98,6.35 0 top
J13  [1X08']  59.69,24.13 180 top
J14  [1X08']  82.55,24.13 180 top
J15  [1X08']  36.83,92.71 0 top
J16  80.01,33.02 90 top
J17  93.98,33.02 90 top
J18  20.32,80.01 180 bottom
J19  [1X08']  77.47,93.98 180 top
L1  62.23,60.96 180 top
L2  62.23,54.61 180 top
L3  62.23,48.26 180 top
LED1  101.6,64.77 0 top
M_GND  4.06,7.62 270 top
MASTER  11.43,2.54 0 top
MDR1  140.97,93.98 0 top
MDR2  161.29,93.98 0 top
MDR3  140.97,83.82 0 top
MDR4  161.29,83.82 0 top
MDR5  140.97,73.66 0 top
MDR6  161.29,73.66 0 top
MDR7  161.29,63.5 0 top
MDR8  161.29,53.34 0 top
NAVBOARD_2.0  12.7,88.9 0 top
OLED  48.26,36.83 0 top
PWR  6.35,19.05 90 top
R1  120.65,71.12 0 top
R2  120.65,74.93 180 top
R3  120.65,78.74 180 top
R4  120.65,82.55 180 top
R5  120.65,86.36 180 top
R6  120.65,90.17 180 top
R7  120.65,93.98 180 top
R8  120.65,97.79 180 top
R9  25.4,17.78 180 top
R10  105.41,55.88 270 top
R11  102.87,55.88 270 top
R12  100.33,55.88 90 top
R13  67.31,59.69 270 top
R14  67.31,49.53 270 top
R15  67.31,39.37 90 top
RST  17.78,30.48 180 top
RST_ESP  121.92,26.67 180 top
SD1  101.6,33.02 90 top
SEL1  107.95,71.88 0 top
SEL2  107.95,74.68 0 top
SEL3  107.95,77.47 0 top
SEL4  107.95,80.26 0 top
SEL5  107.95,83.06 0 top
SEL6  107.95,85.85 0 top
SEL7  107.95,88.65 0 top
SEL8  107.95,91.44 0 top
U1  0,0 0 top
U$1  [LOGO]  142.24,27.94 0 top
U$3  55.88,88.9 180 top
U$4  52.07,88.9 180 top
U$9  96.52,90.17 180 top
US1  121.92,15.24 0 top
US2  135.89,15.24 0 top
US3  149.86,15.24 0 top
US4  121.92,6.35 0 top
US5  135.89,6.35 0 top

### Tracks (layer width: path | path; a pad name or v marks a point on that pad's centre or on a via)
3V3  (via drill 0.35)
  Top 0.152: v17.78,48.9 17.78,50.8 20.32,53.34 IMU_2.P$5 | v37.47,36.2 31.11,29.84 27.94,29.84 26.67,28.57 U1.3.3V | v109.22,22.23 108.58,21.59 108.58,6.35 106.05,3.81 81.92,3.81 v80.64,5.08
  Bottom 0.152: v17.78,48.9 17.14,48.26 17.14,38.73 26.67,29.21 U1.3.3V | v37.47,36.2 IMU1.8 48.26,45.72 60.96,33.02 60.96,24.77 v80.64,5.08 | ESP1.P7 137.16,32.38 127,22.23 v109.22,22.23
7V4
  Top 1.27: U1.VIN C9.+ 34.29,19.05 BUCK.P1 25,12.7 MASTER.2
  Bottom 0.152: 20.32,8.89 MASTER.2
  Bottom 1.27: 20.32,8.89 20.32,13.97 D1.A 12.06,22.23 12.06,26.67 5.08,33.66 5.08,68.58 10.79,74.3 10.79,87.06 NAVBOARD_2.0.P$5
ESP_RX  (via drill 0.35)
  Top 0.152: ESP1.P14 121.28,65.41 v121.28,40.64 | U$9.P17 60.33,87.63 60.33,87 55.88,82.55 55.88,79.38 56.52,78.74 56.52,75.56 52.07,71.12 52.07,54.61 62.23,44.45 62.23,31.75 64.14,29.84 80.01,29.84 81.28,28.57 81.28,22.86 81.92,22.23 v102.87,22.23
  Bottom 0.152: 64.14,94.61 60.33,98.42 26.04,98.42 16.51,88.9 NAVBOARD_2.0.P$2 | 64.14,94.61 64.14,87.63 62.87,86.36 62.23,86.36 60.96,87.63 U$9.P17 | 64.14,94.61 J19.6 | v102.87,22.23 v121.28,40.64
ESP_SCL  (via drill 0.35)
  Top 0.152: IMU2_SCL_SEL.P1 21.59,44.45 v34.92,44.45 | v51.44,46.99 52.07,47.62 52.07,48.9 53.34,50.16 IMU1_SCL_SEL.P1 | v118.11,59.69 113.03,54.61 113.03,47.62 109.22,43.81 109.22,24.77 106.05,21.59 106.05,6.35 104.14,4.45 83.19,4.45 v82.55,5.08
  Bottom 0.152: v34.92,44.45 43.81,44.45 47.62,48.26 50.16,48.26 v51.44,46.99 50.16,46.99 49.53,46.35 49.53,45.09 61.59,33.02 61.59,24.77 64.14,22.23 64.77,22.23 74.93,12.06 75.56,12.06 v82.55,5.08 | ESP1.P13 124.46,65.41 118.75,59.69 v118.11,59.69
ESP_SDA  (via drill 0.35)
  Top 0.152: IMU2_SDA_SEL.P1 20.32,39.37 35.56,39.37 | v36.83,47.62 36.83,40.64 35.56,39.37 | ESP1.P12 126.36,65.41 126.36,46.99 121.92,42.55 121.92,40.01 115.57,33.66 115.57,12.06 v106.05,2.54 | v38.73,22.86 38.73,37.47 36.83,39.37 35.56,39.37
  Bottom 0.152: v36.83,47.62 47.62,58.42 50.16,58.42 52.96,61.21 IMU1_SDA_SEL.P1 | v106.05,2.54 59.05,2.54 v38.73,22.86
ESP_TX  (via drill 0.35)
  Top 0.152: ESP1.P15 118.75,65.41 118.75,52.7 109.86,43.81 109.86,6.99 106.05,3.17 63.5,3.17 61.59,5.08 61.59,18.41 58.42,21.59 58.42,29.84 60.33,31.75 60.33,35.56 50.8,45.09 v50.8,70.48
  Bottom 0.152: NAVBOARD_2.0.P$1 31.11,88.9 40.01,97.79 50.16,97.79 53.34,94.61 53.34,91.44 59.69,85.09 60.96,83.82 | 60.96,83.82 U$9.P18 60.35,83.82 57.15,83.82 55.88,82.55 55.88,80.01 56.52,79.38 56.52,76.2 v50.8,70.48 | J19.5 64.77,91.44 64.77,87.63 62.23,85.09 60.96,83.82
GND  (via drill 0.35)
  other vias: 144.78,88.9 146.05,88.9 147.32,88.9
  pour Top: 0,100.33 172.72,100.33 172.72,-1.27 -1.27,-1.27 -1.27,100.33
  pour Bottom: -1.27,100.33 172.72,100.33 172.72,-1.27 -1.27,-1.27
IMU_SDA
  Bottom 0.152: IMU1_SDA_SEL.P2 52.32,58.67 IMU1.5
IMU_SDA1
  Top 0.152: IMU_2.P$2 20.32,60.33 17.14,57.15 17.14,45.72 20.95,41.91 20.95,41.27 IMU2_SDA_SEL.P2
L1_ANODE  (via drill 0.35)
  Top 0.152: v90.17,40.64 U1.47
  Bottom 0.152: R13.2 68.58,54.61 68.58,49.53 64.77,45.72 64.77,35.56 69.85,30.48 86.36,30.48 87,31.11 88.27,31.11 92.08,34.92 92.08,38.73 v90.17,40.64 J17.4
L2_ANODE
  Bottom 0.152: R14.2 65.41,43.81 65.41,35.56 69.85,31.11 80.64,31.11 81.92,32.38 81.92,36.2 81.28,36.83 | J16.3 81.28,36.83 | 81.28,36.83 U1.48
L3_ANODE  (via drill 0.35)
  Top 0.152: v91.44,38.1 J17.3
  Bottom 0.152: R15.2 67.31,37.47 68.58,36.2 68.58,34.92 69.85,33.66 77.47,33.66 78.74,34.92 78.74,38.73 79.38,39.37 81.92,39.37 84.45,41.91 85.72,41.91 87,40.64 U1.49 88.9,40.64 v91.44,38.1
L4_B
  Bottom 0.152: R10.2 97.79,44.45 91.44,44.45 88.9,41.91 86.36,41.91 U1.46 82.55,43.18 J16.4
L4_G  (via drill 0.35)
  Top 0.152: R11.2 106.05,48.9 106.05,46.99 103.5,44.45 v103.5,43.18 | U1.45 88.9,46.99 90.17,46.99 J17.5
  Bottom 0.152: v103.5,43.18 102.23,41.91 95.25,41.91 J17.5
L4_R  (via drill 0.35)
  Top 0.152: R12.2 99.06,58.42 99.06,53.34 98.42,52.7 v98.42,50.8
  Bottom 0.152: v98.42,50.8 94.61,46.99 91.44,46.99 88.9,44.45 86.36,44.45 U1.44 82.55,45.72 J16.5
MD1_DIR
  Bottom 0.152: MDR1.P$2 141.6,93.98 139.06,96.52 116.2,96.52 115.57,95.89 109.86,95.89 99.69,85.72 99.69,80.01 92.08,72.39 86.36,72.39 U1.22 83.82,72.39 81.28,72.39 J16.16
MD1_ENC_A  (via drill 0.35)
  Top 0.152: v117.47,31.75 117.47,34.29 118.11,34.92 136.53,34.92 158.75,57.15 158.75,64.14 167,72.39 167,95.25 166.37,95.89 142.24,95.89 140.34,93.98 MDR1.P$3 | v104.78,22.86 85.09,22.86 83.82,24.13 83.82,28.57 81.92,30.48 v65.41,30.48 | v50.16,45.72 50.16,70.48 45.72,74.93 45.72,76.83 46.99,78.11 48.26,78.11 | U1.2 49.53,76.83 48.9,77.47 48.26,78.11 | J15.6 48.26,91.44 48.26,78.11
  Bottom 0.152: v117.47,31.75 108.58,22.86 v104.78,22.86 | v50.16,45.72 v65.41,30.48
MD1_ENC_B  (via drill 0.35)
  Top 0.152: v94.61,73.66 92.71,73.66 91.44,72.39 91.44,69.22 89.53,67.31 89.53,60.96 88.27,59.69 86.36,59.69 U1.34
  Bottom 0.152: MDR1.P$4 133.99,93.98 132.08,95.89 125.73,95.89 125.09,95.25 109.86,95.25 100.33,85.72 100.33,80.01 94.61,74.3 v94.61,73.66 | J16.10 82.55,58.42 U1.34
MD1_PWM  (via drill 0.35)
  Top 0.152: U1.4 43.81,76.83 43.81,91.44 44.45,92.08 J15.4 44.45,93.34 45.72,94.61 55.24,94.61 57.78,92.08 59.69,92.08 60.96,93.34 60.96,94.61 61.59,95.25 62.23,95.25 63.5,96.52 v73.66,96.52 | v104.78,71.75 104.78,88.27 97.79,95.25 80.01,95.25 79.38,95.89 v79.38,96.52
  Bottom 0.152: R1.1 114.3,71.12 113.67,70.48 109.22,70.48 107.95,71.75 | v104.78,71.75 107.95,71.75 | v73.66,96.52 v79.38,96.52 | 107.95,71.75 SEL1.1
MD2_DIR  (via drill 0.35)
  Top 0.152: J17.16 94.61,71.12 v95.89,72.39 95.89,73.66 95.25,74.3 v92.71,74.3
  Bottom 0.152: v95.89,72.39 98.42,69.85 129.54,69.85 140.97,81.28 140.97,84.45 141.6,85.09 146.05,85.09 146.69,85.72 153.67,85.72 161.93,93.98 MDR2.P$2 | U1.23 92.08,73.66 v92.71,74.3
MD2_ENC_A  (via drill 0.35)
  Top 0.152: U1.3 51.44,71.75 51.44,54.61 61.59,44.45 61.59,21.59 62.87,20.32 80.01,20.32 80.04,20.35 80.26,20.35 81.5,21.59 v100.33,21.59
  Bottom 0.152: v100.33,21.59 135.25,21.59 166.37,52.7 166.37,94.61 165.74,95.25 161.93,95.25 160.66,93.98 MDR2.P$3 | U1.3 J15.5
MD2_ENC_B  (via drill 0.35)
  Top 0.152: v135.89,87 v137.79,85.09 | v99.06,71.12 97.16,69.22 v97.16,68.58 | v92.71,69.85 90.17,67.31 90.17,62.23 | 90.17,62.23 90.17,60.96 U1.35 | J17.10 92.71,55.88 92.68,55.91 91.82,55.91 91.44,56.29 91.44,60.96 90.17,62.23
  Bottom 0.152: MDR2.P$4 154.31,93.98 146.05,85.72 139.7,85.72 139.06,85.09 v137.79,85.09 | v135.89,87 131.44,87 130.18,85.72 127,85.72 125.09,83.82 120.02,83.82 115.57,79.38 114.3,79.38 113.67,78.74 106.68,78.74 v99.06,71.12 | v97.16,68.58 95.89,69.85 v92.71,69.85
MD2_PWM  (via drill 0.35)
  Top 0.152: U1.5 41.27,76.83 41.27,91.44 41.91,92.08 J15.3 | v121.92,77.47 R2.1 | v52.7,69.22 57.78,74.3 57.78,76.83 59.69,78.74 62.23,78.74 64.14,80.64 64.14,83.19 67.31,86.36 74.93,86.36 75.56,87 v75.56,92.08 | v90.17,92.08 99.06,92.08 99.69,91.44 99.69,79.38 103.5,75.56 v103.5,72.39
  Bottom 0.152: v121.92,77.47 118.11,77.47 116.84,76.2 109.86,76.2 107.95,74.3 SEL2.1 107.95,74.93 106.68,73.66 104.78,73.66 v103.5,72.39 | U1.5 48.9,69.22 v52.7,69.22 | v90.17,92.08 v75.56,92.08
MD3_DIR
  Bottom 0.152: MDR3.P$2 141.6,83.82 141.6,81.28 129.54,69.22 97.79,69.22 93.98,73.03 93.34,73.03 90.17,69.85 86.36,69.85 U1.24 82.55,71.12 J16.15
MD3_ENC_A  (via drill 0.35)
  Top 0.152: v116.2,92.08 114.94,93.34 v114.94,97.16 | v137.79,81.92 133.99,81.92 133.35,82.55 133.35,84.45 130.81,87 129.54,87 v128.91,87.63
  Bottom 0.152: v137.79,81.92 139.7,83.82 MDR3.P$3 | v128.91,87.63 125.09,91.44 116.84,91.44 v116.2,92.08 | v114.94,97.16 113.03,97.16 111.76,98.42 74.3,98.42 J19.4 70.48,93.98 76.2,88.27 76.2,87.4 U$9.P24
MD3_ENC_B  (via drill 0.35)
  Top 0.152: v120.65,76.2 118.75,74.3 118.75,69.85 v116.2,67.31 | v90.81,60.33 88.9,58.42 88.9,57.78 88.27,57.15 86.36,57.15 U1.36
  Bottom 0.152: MDR3.P$4 134.62,83.82 127,76.2 v120.65,76.2 | v116.2,67.31 99.06,67.31 95.25,63.5 95.25,62.87 94.61,62.23 92.71,62.23 v90.81,60.33 | J16.9 82.55,55.88 U1.36
MD3_PWM  (via drill 0.35)
  Top 0.152: U1.6 38.73,76.83 38.73,91.44 39.37,92.08 J15.2 | v114.94,77.47 113.67,78.74 109.22,78.74 SEL3.1 | v71.75,90.81 73.66,92.71 73.66,94.61 74.3,95.25 78.11,95.25 78.74,94.61 78.74,92.71 v81.92,89.53 | v100.33,88.27 101.6,87 v101.6,78.74 | v100.33,77.47 100.97,76.83 v100.97,71.75
  Bottom 0.152: R3.1 118.75,78.74 117.47,77.47 v114.94,77.47 | U1.6 41.27,78.11 44.45,78.11 45.72,76.83 45.72,74.3 50.16,69.85 51.44,69.85 57.15,75.56 57.15,76.83 59.69,79.38 62.87,79.38 64.14,80.64 64.14,86.36 65.41,87.63 65.41,88.9 67.31,90.81 v71.75,90.81 | v81.92,89.53 86.36,89.53 89.53,86.36 98.42,86.36 v100.33,88.27 | v100.33,77.47 v101.6,78.74 | v100.97,71.75 100.97,72.39 105.41,76.83 107.31,76.83 SEL3.1
MD4_DIR  (via drill 0.35)
  Top 0.152: v149.86,69.22 148.59,67.94 v148.59,66.04 | v97.16,64.14 95.89,65.41 95.89,66.67 94.61,67.94 | U1.25 90.17,71.12 90.81,71.75 90.81,73.66 92.08,74.93 95.25,74.93 96.52,73.66 96.52,71.12 94.61,69.22 94.61,67.94 | 94.61,67.94 J17.15
  Bottom 0.152: v149.86,69.22 161.93,81.28 161.93,83.2 MDR4.P$2 | v148.59,66.04 139.06,66.04 138.43,65.41 138.43,64.77 131.44,57.78 100.33,57.78 97.16,60.96 v97.16,64.14
MD4_ENC_A  (via drill 0.35)
  Top 0.152: MDR4.P$3 159.38,83.82 152.4,90.81 v132.08,90.81 | v126.36,92.71 117.7,92.71 116.46,91.47 115.6,91.47 115.57,91.44 114.94,92.08 114.94,92.71 114.3,93.34 114.3,96.52 113.67,97.16 v111.76,97.16
  Bottom 0.152: v132.08,90.81 128.27,90.81 v126.36,92.71 | v111.76,97.16 110.49,97.16 99.06,85.72 86.36,85.72 85.72,85.09 | 85.72,85.09 84.45,83.82 U$9.P30 | J19.3 76.83,89.53 76.83,87.63 79.38,85.09 85.72,85.09
MD4_ENC_B  (via drill 0.35)
  Top 0.152: v147.32,74.93 146.05,73.66 146.05,59.69 v133.35,46.99 | v103.5,45.72 101.6,47.62 97.79,47.62 97.16,48.26 97.16,49.53 96.52,50.16 96.52,51.44 94.61,53.34 J17.9 93.34,53.34 90.81,55.88 U1.37
  Bottom 0.152: MDR4.P$4 156.21,83.82 v147.32,74.93 | v133.35,46.99 110.49,46.99 107.31,43.81 105.41,43.81 v103.5,45.72
MD4_PWM  (via drill 0.35)
  Top 0.152: J15.1 36.83,92.08 36.2,91.44 36.2,76.83 U1.7 44.45,68.58 v44.45,67.31 | v121.92,85.09 R4.1 | v64.77,67.31 70.48,73.03 v79.38,73.03 | v99.06,76.83 v95.25,76.83
  Bottom 0.152: v121.92,85.09 114.3,85.09 113.67,84.45 107.31,84.45 106.05,83.19 106.05,81.92 107.95,80.01 | v64.77,67.31 v44.45,67.31 | v79.38,73.03 82.55,73.03 84.45,74.93 93.34,74.93 v95.25,76.83 | v99.06,76.83 102.23,76.83 105.41,80.01 107.95,80.01 | 107.95,80.01 SEL4.1
MD5_DIR
  Bottom 0.152: MDR5.P$2 141.6,73.66 137.16,69.22 130.18,69.22 129.54,68.58 98.42,68.58 97.16,67.31 86.36,67.31 U1.26 82.55,68.58 J16.14
MD5_ENC_A  (via drill 0.35)
  Top 0.152: v139.7,65.41 139.7,73.66 MDR5.P$3
  Bottom 0.152: v139.7,65.41 131.44,57.15 92.71,57.15 88.9,60.96 88.9,61.59 88.27,62.23 86.36,62.23 U1.30 82.55,63.5 J16.12
MD5_ENC_B  (via drill 0.35)
  Top 0.152: v139.06,61.59 139.06,72.39 137.79,73.66 MDR5.P$4 | v95.89,50.8 94.61,52.07 93.34,52.07 90.81,54.61 86.36,54.61 U1.38
  Bottom 0.152: v139.06,61.59 133.99,56.52 133.35,56.52 132.08,55.24 100.33,55.24 v95.89,50.8 | J16.8 82.55,53.34 U1.38
MD5_PWM  (via drill 0.35)
  Top 0.152: R5.1 121.92,86.36 121.28,85.72 121.28,79.38 v123.19,77.47 | v127.64,78.74 127.64,72.39 129.54,70.48 130.81,70.48 130.84,70.46 131.7,70.46 132.08,70.07 132.08,68.58 130.81,67.31 130.81,50.16 v122.56,41.91 | v59.05,67.94 65.41,61.59 65.41,40.01 68.58,36.83 68.58,33.02 70.48,31.11 81.92,31.11 84.45,28.57 84.45,25.4 85.09,24.77 v97.16,24.77 | J18.6 31.75,78.74 31.75,77.47 32.38,76.83 32.38,76.2 U1.8 | v106.05,86.36 106.05,85.09 107.95,83.19 SEL5.1 | v109.86,93.98 107.95,95.89 v107.95,96.52 | v46.99,97.16 48.26,98.42 64.77,98.42 65.41,97.79 v106.68,97.79
  Bottom 0.152: v123.19,77.47 126.36,77.47 v127.64,78.74 | v122.56,41.91 118.11,41.91 108.58,32.38 104.78,32.38 v97.16,24.77 | v59.05,67.94 40.64,67.94 32.38,76.2 U1.8 | v106.05,86.36 106.05,88.9 107.31,90.17 108.58,90.17 109.22,90.81 109.22,93.34 v109.86,93.98 | v106.68,97.79 v107.95,96.52 | v46.99,97.16 43.18,93.34 43.18,90.17 J18.6
MD6_DIR  (via drill 0.35)
  Top 0.152: v154.31,62.87 154.31,66.04 161.93,73.66 MDR6.P$2 | v105.41,54.61 101.6,58.42 101.6,60.33 98.42,63.5 | 98.42,63.5 96.52,63.5 J17.14 | U1.27 86.36,69.85 86.36,71.75 87,72.39 88.9,72.39 92.08,75.56 96.52,75.56 97.16,74.93 97.16,69.85 96.52,69.22 96.52,66.04 97.79,64.77 97.79,64.14 98.42,63.5
  Bottom 0.152: v154.31,62.87 147.32,55.88 133.35,55.88 132.08,54.61 v105.41,54.61
MD6_ENC_A  (via drill 0.35)
  Top 0.152: v154.31,67.94 160.02,73.66 MDR6.P$3 | v132.72,60.96 138.43,60.96 138.46,60.99 139.32,60.99 139.67,61.34 139.67,62.2 v145.41,67.94 | v96.52,61.59 v97.79,61.59 | J17.12 v91.44,63.5
  Bottom 0.152: v145.41,67.94 v154.31,67.94 | v132.72,60.96 120.65,60.96 118.75,59.05 107.95,59.05 105.41,61.59 v97.79,61.59 | v96.52,61.59 94.61,61.59 J17.12 | v91.44,63.5 U1.31
MD6_ENC_B  (via drill 0.35)
  Top 0.152: MDR6.P$4 154.94,73.66 153.67,72.39 153.67,52.7 149.22,48.26 v135.89,48.26 | v105.41,48.26 103.5,50.16 v100.33,50.16 | U1.39 91.44,53.34 J17.8
  Bottom 0.152: v105.41,48.26 v135.89,48.26 | v100.33,50.16 99.06,51.44 97.79,51.44 96.52,50.16 94.61,50.16 J17.8
MD6_PWM  (via drill 0.35)
  Top 0.152: J18.5 30.48,79.38 29.84,78.74 29.84,76.2 U1.9 | v110.49,97.79 115.57,97.79 115.77,97.59 115.77,96.95 118.14,94.59 118.14,94.36 118.49,94.01 119,94.01 119.35,94.36 119.35,95.22 120.02,95.89 124.46,95.89 126.97,93.37 126.97,92.46 126.62,92.1 126.39,92.1 R6.1 | v106.05,93.98 106.05,87.63 107.82,85.85 SEL6.1 | v62.87,66.67 70.48,74.3 75.56,74.3 76.2,74.93 v76.2,77.47 | v78.74,78.74 81.92,81.92 83.82,81.92 84.45,82.55 86.86,82.55 87.63,83.32 87.63,90.81 90.17,93.34 v98.42,93.34
  Bottom 0.152: 108.58,95.89 106.68,93.98 v106.05,93.98 | 108.58,95.89 v110.49,97.79 | v62.87,66.67 39.37,66.67 30.48,75.56 30.48,76.2 U1.9 | v76.2,77.47 77.47,78.74 v78.74,78.74 | v98.42,93.34 102.87,93.34 105.41,95.89 108.58,95.89
MD7_DIR
  Bottom 0.152: MDR7.P$2 161.93,63.5 156.84,68.58 130.18,68.58 129.54,67.94 98.42,67.94 95.25,64.77 86.36,64.77 U1.28 82.55,66.04 J16.13
MD7_ENC_A
  Bottom 0.152: MDR7.P$3 159.38,63.5 157.48,65.41 140.97,65.41 132.08,56.52 96.52,56.52 94.61,54.61 92.71,54.61 88.9,58.42 88.9,59.05 88.27,59.69 86.36,59.69 U1.32 82.55,60.96 J16.11
MD7_ENC_B
  Bottom 0.152: MDR7.P$4 153.67,63.5 152.4,62.23 138.43,62.23 132.08,55.88 98.42,55.88 94.61,52.07 86.36,52.07 U1.40 82.55,50.8 J16.7
MD7_PWM  (via drill 0.35)
  Top 0.152: U1.10 27.3,76.2 27.3,78.74 27.94,79.38 J18.4 34.92,87 34.92,92.71 38.1,95.89 v60.33,95.89 | v127.64,93.98 127.64,91.44 125.73,89.53 v125.73,88.9 | v114.94,88.9 114.3,89.53 114.3,92.71 v113.67,93.34 | v62.87,97.16 v61.59,95.89 | v76.83,95.89 v64.14,95.89 | v93.98,95.89 104.78,95.89 106.05,97.16 110.49,97.16 111.12,96.52 v111.12,93.98
  Bottom 0.152: v127.64,93.98 R7.1 | v114.94,88.9 v125.73,88.9 | v113.67,93.34 113.03,93.34 112.39,92.71 | 112.39,92.71 111.76,92.08 111.76,90.81 111.12,90.17 109.86,90.17 108.33,88.65 SEL7.1 | v61.59,95.89 v60.33,95.89 | v64.14,95.89 v62.87,97.16 | v93.98,95.89 v76.83,95.89 | 112.39,92.71 v111.12,93.98
MD8_DIR  (via drill 0.35)
  Top 0.152: v100.33,53.98 99.06,52.7 99.06,50.58 98.68,50.19 98.17,50.19 97.82,50.55 97.79,50.58 97.79,50.83 97.79,59.05 95.25,61.59 95.25,62.23 J17.13 v91.44,66.04
  Bottom 0.152: v100.33,53.98 132.08,53.98 133.35,55.24 160.02,55.24 161.93,53.34 MDR8.P$2 | v91.44,66.04 U1.29
MD8_ENC_A  (via drill 0.35)
  Top 0.152: v92.08,56.52 J17.11 97.16,55.24 97.16,50.16 98.42,48.9 v103.5,48.9
  Bottom 0.152: MDR8.P$3 159.38,53.34 158.12,54.61 139.06,54.61 133.35,48.9 v103.5,48.9 | v92.08,56.52 U1.33
MD8_ENC_B  (via drill 0.35)
  Top 0.152: v103.5,47.62 102.23,47.62 101.6,48.26 v98.42,48.26 | v96.52,46.35 94.61,48.26 J17.7
  Bottom 0.152: MDR8.P$4 154.31,53.34 148.59,47.62 v103.5,47.62 | v96.52,46.35 v98.42,48.26 | U1.41 91.44,50.8 J17.7
MD8_PWM  (via drill 0.35)
  Top 0.152: J18.3 25.4,79.38 24.77,78.74 24.77,76.2 U1.11 | R8.1 132.08,97.79 133.35,96.52 133.35,93.34 127,87 127,71.75 125.09,69.85 122.56,69.85 121.28,71.12 v121.28,71.75 | v114.94,71.75 114.94,71.12 113.67,69.85 107.31,69.85 106.05,71.12 v106.05,80.64 | v76.2,78.74 77.47,80.01 v77.47,80.64 | v84.45,80.64 87.63,80.64 88.27,80.01 88.27,78.11 90.17,76.2 97.16,76.2 v97.79,75.56
  Bottom 0.152: v121.28,71.75 118.11,71.75 117.47,72.39 115.57,72.39 v114.94,71.75 | v106.05,80.64 106.05,81.28 105.41,81.92 105.41,84.45 | 105.41,84.45 105.41,88.9 SEL8.1 | J18.3 27.3,78.11 33.02,78.11 42.55,68.58 66.67,68.58 73.66,75.56 73.66,76.83 75.56,78.74 v76.2,78.74 | v84.45,80.64 v77.47,80.64 | v97.79,75.56 97.79,76.83 105.41,84.45
MEGA_SCL  (via drill 0.35)
  Top 0.152: U1.21 78.11,76.83 78.11,81.92 76.83,83.19 76.83,92.71 77.47,93.34 J19.1 | v33.02,46.99 24.13,46.99 IMU2_SCL_SEL.P3
  Bottom 0.152: v33.02,46.99 34.92,45.09 41.91,45.09 47.62,50.8 48.9,50.8 52.07,47.62 52.07,45.72 53.09,44.7 IMU1_SCL_SEL.P3 54.23,44.7 62.23,52.7 62.23,55.24 68.58,61.59 68.58,69.22 69.22,69.85 71.12,69.85 U1.21
MEGA_SCL1
  Top 0.152: J13.3 53.98,24.77 53.98,26.67 54.61,27.3 U1.A5 54.61,29.23 OLED.P$3
MEGA_SDA  (via drill 0.35)
  Top 0.152: U1.20 75.56,76.83 75.56,82.55 76.2,83.19 76.2,92.71 J19.2 | IMU2_SDA_SEL.P3 24.13,41.27 34.29,41.27 35.56,42.55 v35.56,45.72
  Bottom 0.152: v35.56,45.72 40.01,45.72 47.62,53.34 50.16,53.34 52.96,56.13 IMU1_SDA_SEL.P3 58.04,56.13 62.23,60.33 62.23,63.5 U1.20
MEGA_SDA1
  Top 0.152: J13.4 51.44,24.77 51.44,26.67 52.07,27.3 U1.A4 44.51,35.5 OLED.P$4
N$0  (via drill 0.35)
  Top 0.152: v156.21,66.67 160.02,66.67 166.37,73.03 166.37,92.71 165.1,93.98 MDR2.P$1 | v106.05,66.67 102.23,70.48 v102.23,72.39 | v106.68,75.56 107.31,76.2 108.58,76.2 109.54,75.25 110.11,74.68 SEL2.2
  Bottom 0.152: v156.21,66.67 142.24,66.67 140.97,67.94 130.18,67.94 129.54,67.31 117.47,67.31 116.84,66.67 v106.05,66.67 | v102.23,72.39 105.41,75.56 v106.68,75.56
N$1
  Bottom 0.152: C2.+ 147.32,93.98 139.06,85.72 135.89,85.72 127,76.83 118.75,76.83 R2.2 113.28,74.93 SEL2.3
N$2  (via drill 0.35)
  Top 0.152: v131.44,69.85 125.73,69.85 125.09,69.22 121.28,69.22 120.65,69.85 v120.65,73.66 | v115.57,73.66 114.3,74.93 114.3,75.56 113.67,76.2 111.12,76.2 110.49,76.83 SEL3.2
  Bottom 0.152: v131.44,69.85 131.44,70.48 144.15,83.19 144.15,83.82 MDR3.P$1 | v115.57,73.66 v120.65,73.66
N$3  (via drill 0.35)
  Top 0.152: v123.19,81.28 124.46,81.28 125.73,80.01 125.73,74.3 124.46,73.03 122.14,73.03 120.9,74.27 120.4,74.27 120.02,73.88 120.02,69.22 116.81,66.01 116.81,65.79 116.43,65.41 115.98,65.41 115.57,65.82 115.57,71.98 115.19,72.36 114.68,72.36 114.33,72.01 114.33,71.15 113.67,70.48 111.12,70.48 110.49,71.12 SEL1.2
  Bottom 0.152: v123.19,81.28 125.09,81.28 128.91,85.09 130.18,85.09 131.44,86.36 139.06,86.36 144.15,91.44 144.15,93.41 MDR1.P$1
N$4
  Bottom 0.152: C3.+ 128.27,83.82 125.09,80.64 118.75,80.64 R3.2 114.3,78.74 SEL3.3
N$5  (via drill 0.35)
  Top 0.152: v139.06,87.63 142.88,87.63 146.69,83.82 C4.+ | R4.2 116.84,81.28 116.2,80.64 113.41,80.64 SEL4.3
  Bottom 0.152: v139.06,87.63 131.44,87.63 130.18,86.36 126.36,86.36 124.46,84.45 118.75,84.45 R4.2
N$6  (via drill 0.35)
  Top 0.152: C8.+ 148.59,53.34 147.96,53.98 147.96,75.56 141.6,81.92 139.06,81.92 138.43,82.55 138.43,85.72 v135.25,88.9 | v118.75,94.61 116.84,96.52 R8.2 | v113.03,96.52 SEL8.3
  Bottom 0.152: v135.25,88.9 128.91,88.9 125.09,92.71 120.65,92.71 v118.75,94.61 | v113.03,96.52 115.57,96.52 R8.2
N$7  (via drill 0.35)
  Top 0.152: v141.6,79.38 130.81,79.38 v129.54,80.64 | v120.65,80.01 119.38,81.28 119.38,87.63 R6.2 115.57,88.9 115.57,88.27 113.16,85.85 SEL6.3
  Bottom 0.152: C6.+ 147.32,73.66 v141.6,79.38 | v129.54,80.64 125.73,80.64 125.09,80.01 v120.65,80.01
N$8  (via drill 0.35)
  Top 0.152: v138.43,69.22 138.43,64.77 137.79,64.14 v133.99,64.14 | v121.92,64.14 v124.46,64.14 | v100.97,62.23 97.79,65.41 97.79,68.58 99.69,70.48 99.69,78.74 99.06,79.38 99.06,83.82 97.79,85.09 v97.79,87 | v106.05,95.25 109.22,92.08 109.22,81.28 110.24,80.26 SEL4.2
  Bottom 0.152: v138.43,69.22 139.06,69.85 149.86,69.85 161.29,81.28 161.29,84.45 161.93,85.09 163.19,85.09 164.47,83.82 MDR4.P$1 | v124.46,64.14 v133.99,64.14 | v121.92,64.14 106.05,64.14 104.14,62.23 v100.97,62.23 | v106.05,95.25 v97.79,87
N$9  (via drill 0.35)
  Top 0.152: v148.59,45.72 156.84,45.72 164.47,53.34 MDR8.P$1 | v108.58,43.81 108.58,67.94 105.41,71.12 105.41,95.47 105.79,95.86 106.3,95.86 106.65,95.5 106.65,95.28 107.95,93.98 SEL8.2
  Bottom 0.152: v148.59,45.72 116.2,45.72 114.3,43.81 v108.58,43.81
N$10  (via drill 0.35)
  Top 0.152: v119.38,76.2 118.75,76.83 118.75,84.45 R5.2 116.2,86.36 113.03,83.19 SEL5.3
  Bottom 0.152: C5.+ 125.73,73.66 125.09,73.03 122.56,73.03 v119.38,76.2
N$11
  Bottom 0.152: IMU1_SCL_SEL.P2 53.09,47.24 IMU1.6
N$12
  Top 0.508: R9.2 20.32,17.78 19.05,19.05 D1.K
N$13
  Top 0.152: R10.1 103.5,61.59 103.5,63.5 LED1.4
N$14
  Top 0.152: J13.8 41.27,24.77 41.27,26.67 41.91,27.3 U1.A0
N$15
  Top 0.152: C1.+ 129.54,93.98 128.27,92.71 128.27,88.9 126.36,87 126.36,73.03 R1.2
  Bottom 0.152: R1.2 123.19,72.39 122.56,72.39 121.92,73.03 115.57,73.03 114.94,72.39 113.03,72.39 SEL1.3
N$16  (via drill 0.35)
  Top 0.152: v128.91,75.56 142.24,75.56 144.15,73.66 MDR5.P$1 | v123.19,73.66 121.28,75.56 120.65,75.56 119.38,74.3 119.38,69.22 v116.2,66.04 | v107.95,66.04 104.14,69.85 v104.14,77.47 | v106.68,79.38 107.31,78.74 108.58,78.74 v109.22,79.38
  Bottom 0.152: v128.91,75.56 127,75.56 125.09,73.66 v123.19,73.66 | v107.95,66.04 v116.2,66.04 | v104.14,77.47 106.05,79.38 v106.68,79.38 | v109.22,79.38 109.22,81.92 110.49,83.19 SEL5.2
N$17  (via drill 0.35)
  Top 0.152: v130.18,87.63 130.18,88.9 130.81,89.53 148.59,89.53 164.47,73.66 MDR6.P$1 | v116.2,88.27 114.3,86.36 114.3,85.09 113.67,84.45 111.12,84.45 110.49,85.09 SEL6.2
  Bottom 0.152: v130.18,87.63 129.54,87 125.73,87 124.46,88.27 v116.2,88.27
N$18
  Top 0.152: U1.0 52.7,78.11 52.7,83.82 53.98,85.09 U$3.P2
N$19
  Top 0.152: U1.1 52.07,83.82 50.8,85.09 U$4.P2
N$20
  Top 0.152: IMU_2.P$3 21.59,58.42 22.23,57.78 22.23,48.9 21.59,48.26 21.59,47.62 IMU2_SCL_SEL.P2
N$21  (via drill 0.35)
  Top 0.152: v137.16,88.27 140.97,84.45 140.97,83.19 148.59,75.56 148.59,73.03 150.5,71.12 150.5,63.5 C7.+
  Bottom 0.152: v137.16,88.27 128.91,88.27 125.09,92.08 118.75,92.08 R7.2 115.57,92.71 115.57,91.44 113.03,88.9 SEL7.3
N$22  (via drill 0.35)
  Top 0.152: v92.71,41.91 89.53,45.09 v89.53,46.35 | v82.55,46.99 82.55,73.03 84.45,74.93 85.47,74.93 86.36,75.82 86.36,77.47 83.82,80.01 83.82,81.28 84.45,81.92 87.63,81.92 88.27,82.55 v88.27,88.9 | v106.68,96.52 109.25,93.95 109.25,93.73 109.63,93.34 111.12,93.34 111.76,92.71 111.76,89.53 110.87,88.65 SEL7.2
  Bottom 0.152: v92.71,41.91 94.61,41.91 99.69,36.83 112.39,36.83 120.65,45.09 156.21,45.09 163.83,52.7 163.83,53.98 165.04,55.19 MDR7.P$1 | v89.53,46.35 88.9,46.99 v82.55,46.99 | v88.27,88.9 95.89,96.52 v106.68,96.52
N$23
  Top 0.152: J13.7 43.81,24.77 43.81,26.67 44.45,27.3 U1.A1
N$24
  Bottom 0.152: ESP1.P0 119.38,32.38 122.56,29.21 124.89,29.21 RST_ESP.3
N$25
  Top 0.152: J13.6 46.35,24.77 46.35,26.67 46.99,27.3 U1.A2
N$26
  Top 0.152: J13.5 48.9,24.77 48.9,26.67 49.53,27.3 U1.A3
N$29
  Top 0.152: J15.8 54.61,87.63 U$3.P3
N$30
  Top 0.152: J15.7 50.8,91.44 50.8,87.63 U$4.P3
N$31
  Top 0.152: R11.1 102.23,60.33 102.23,65.41 LED1.3
N$32  (via drill 0.35)
  Top 0.152: v107.95,53.34 107.95,63.5 103.5,67.94 100.33,67.94 99.69,67.31 99.69,66.04 LED1.1
  Bottom 0.152: R12.1 101.6,53.34 v107.95,53.34
N$36
  Bottom 0.152: L1.A 66.04,63.5 R13.1
N$37
  Bottom 0.152: L2.A 66.04,54.61 R14.1
N$38
  Top 0.152: R15.1 63.5,39.37 L3.A
N&N
  Bottom 2.54: PWR.2 13.34,14.61 13.34,8.89 MASTER.1
PIN12
  Top 0.152: J18.2 22.86,79.38 22.23,78.74 22.23,76.2 U1.12
PIN13
  Top 0.152: J18.1 20.32,79.38 19.68,78.74 19.68,76.2 U1.13
PIN42  (via drill 0.35)
  Top 0.152: v93.34,31.11 90.81,33.66 90.81,41.91 88.27,44.45 87.25,44.45 86.36,45.34 86.36,46.99 U1.42
  Bottom 0.152: J16.6 82.55,48.26 U1.42 | v93.34,31.11 102.87,31.11 107.04,35.28 B3.1
PIN43  (via drill 0.35)
  Top 0.152: U1.43 91.44,48.26 93.34,46.35 | v97.79,43.81 95.25,46.35 93.34,46.35 | 93.34,46.35 J17.6
  Bottom 0.152: v97.79,43.81 101.6,47.62 102.23,47.62 103.5,46.35 106.32,46.35 B4.1
RST_MEGA  (via drill 0.35)
  Top 0.152: U1.RESET 21.59,30.48 21.59,32.38 RST.3 | ESP1.P6 133.99,32.38 133.99,27.94 121.92,15.88 121.92,12.7 v112.39,3.17
  Bottom 0.152: v112.39,3.17 109.86,3.17 109.22,2.54 107.31,2.54 106.05,3.81 60.33,3.81 58.42,5.71 58.42,6.99 53.34,12.06 50.8,12.06 36.83,26.04 26.04,26.04 U1.RESET
RST_NANO
  Top 0.152: ESP1.P4 129.54,31.11 119.38,20.95 119.38,13.34 111.76,5.71 111.76,2.54 111.12,1.91 57.15,1.91 52.7,6.35 51.44,6.35 40.01,17.78 40.01,46.35 13.34,73.03 13.34,82.55 6.99,88.9 NAVBOARD_2.0.P$6
RX1
  Bottom 0.152: U1.19 75.56,79.38 86.36,79.38 90.17,83.19 U$9.P33
RX2
  Top 0.152: U1.17 67.31,76.83 66.67,77.47 66.67,83.19 U$9.P21
RX3  (via drill 0.35)
  Top 0.152: v77.47,85.09 77.47,87 78.11,87.63 U$9.P8 | U1.15 v65.41,79.38
  Bottom 0.152: v77.47,85.09 71.75,79.38 v65.41,79.38
RX3_EN
  Top 0.152: U$9.P11 72.39,88.27 68.58,92.08 64.14,92.08 J19.7
SD1_MISO
  Top 0.152: J16.2 82.55,35.56 83.19,36.2 | U1.50 83.19,36.2 | SD1.4 98.42,43.81 98.42,45.72 94.61,49.53 83.82,49.53 83.19,48.9 83.19,36.2
SD1_MOSI  (via drill 0.35)
  Top 0.152: v91.44,35.56 J17.2 95.89,37.47 96.52,38.1 SD1.3
  Bottom 0.152: U1.51 88.9,38.1 v91.44,35.56
SD1_SCK
  Top 0.152: J16.1 82.55,33.02 U1.52 86.36,34.29 88.27,34.29 93.34,29.21 100.33,29.21 103.5,32.38 103.5,33.66 SD1.2
SD1_SS
  Top 0.152: U1.53 92.71,30.48 93.34,29.84 95.25,29.84 | J17.1 93.98,32.38 94.61,31.75 94.61,30.48 95.25,29.84 | SD1.1 98.42,29.84 95.25,29.84
TX1
  Bottom 0.152: U1.18 71.75,78.11 73.03,78.11 78.11,83.19 U$9.P27
TX2
  Bottom 0.152: U1.16 64.77,86.36 66.04,87.63 U$9.P14
TX3  (via drill 0.35)
  Top 0.152: v90.17,85.09 90.17,87.63 U$9.P2
  Bottom 0.152: v90.17,85.09 85.09,80.01 75.56,80.01 73.03,77.47 71.75,77.47 71.12,76.83 71.12,75.56 69.85,74.3 61.59,74.3 U1.14
TX3_EN
  Top 0.152: J19.8 60.96,95.25 60.96,96.52 62.23,97.79 63.7,97.79 64.34,97.16 76.83,97.16 79.38,94.61 79.38,93.34 84.45,88.27 U$9.P5
US1_NC
  Bottom 0.152: US1.P$3 120.02,15.24 118.75,13.97 106.05,13.97 95.89,24.13 85.09,24.13 83.19,26.04 69.22,26.04 | U1.A9 69.22,26.04 | 69.22,26.04 J14.7
US1_SIG
  Top 0.152: J14.8 64.14,24.77 64.14,26.67 64.77,27.3 U1.A8
  Bottom 0.152: US1.P$4 105.41,15.24 95.89,24.77 87,24.77 84.45,27.3 84.45,28.57 83.19,29.84 66.67,29.84 U1.A8
US2_NC
  Top 0.152: U1.A11 71.75,27.3 71.75,25.4 72.39,24.77 J14.5
  Bottom 0.152: US4.P$3 120.02,6.35 114.3,12.06 90.81,12.06 80.64,22.23 74.3,22.23 J14.5
US2_SIG
  Top 0.152: U1.A10 69.22,27.3 69.22,25.4 69.85,24.77 J14.6
  Bottom 0.152: US4.P$4 107.31,6.35 102.23,11.43 90.81,11.43 80.64,21.59 72.39,21.59 J14.6
US3_NC  (via drill 0.35)
  Top 0.152: v87.63,20.95 v102.87,20.95 | U1.A13 76.83,27.3 76.83,25.4 77.47,24.77 J14.3
  Bottom 0.152: US2.P$3 133.99,15.24 128.27,20.95 v102.87,20.95 | v87.63,20.95 83.19,25.4 78.74,25.4 J14.3
US3_SIG  (via drill 0.35)
  Top 0.152: v85.09,20.32 v101.6,20.32 | U1.A12 74.3,27.3 74.3,25.4 74.93,24.77 J14.4
  Bottom 0.152: US2.P$4 128.27,15.24 123.19,20.32 v101.6,20.32 | v85.09,20.32 83.19,20.32 80.64,22.86 76.2,22.86 J14.4
US4_NC  (via drill 0.35)
  Top 0.152: v92.71,19.68 v101.6,10.79 | U1.A15 81.92,27.3 81.92,25.4 82.55,24.77 J14.1
  Bottom 0.152: US5.P$3 133.99,6.35 132.08,4.45 108.58,4.45 102.23,10.79 v101.6,10.79 | v92.71,19.68 87,19.68 J14.1
US4_SIG  (via drill 0.35)
  Top 0.152: US5.P$4 128.27,6.35 127.64,5.71 v127.64,3.81 | v80.01,20.95 79.38,21.59 79.38,22.86 | 79.38,22.86 80.01,23.5 J14.2 | U1.A14 79.38,27.3 79.38,22.86
  Bottom 0.152: v127.64,3.81 108.58,3.81 102.23,10.16 85.72,10.16 80.01,15.88 v80.01,20.95
US5_NC  (via drill 0.35)
  Top 0.152: v104.78,17.14 99.69,17.14 99.69,13.97 101.92,11.75 102.55,11.75 102.87,11.43 102.87,10.79 102.23,10.16 97.79,10.16 96.52,11.43 96.52,14.61 91.44,19.68 62.87,19.68 60.96,21.59 60.96,22.86 60.33,23.5 | U1.A7 60.33,27.3 60.33,23.5 | 60.33,23.5 J13.1
  Bottom 0.152: US3.P$3 147.96,15.24 146.69,16.51 143.51,16.51 140.34,13.34 129.54,13.34 125.73,17.14 v104.78,17.14
US5_SIG  (via drill 0.35)
  Top 0.152: v55.24,5.08 55.24,22.23 56.52,23.5 | U1.A6 56.52,27.3 56.52,23.5 | 56.52,23.5 J13.2
  Bottom 0.152: US3.P$4 144.15,15.24 135.89,6.99 135.89,5.71 132.08,1.91 58.42,1.91 v55.24,5.08
VCC  (via drill 0.35)
  Top 0.152: 123.19,6.35 US4.P$2 | 123.19,15.24 US1.P$2 | US5.P$2 137.16,6.35 137.16,11.43 137.16,12.7 137.16,15.24 US2.P$2 | 59.69,6.35 J8.1 | 59.69,13.97 J9.1 | 52.07,12.7 BUCK.P3 | 104.14,6.35 J10.1 | 95.25,6.35 J12.1 | 95.25,13.97 J1.1 | 86.36,6.35 J2.1 | 86.36,13.97 J3.1 | 68.58,6.35 J6.1 | 68.58,13.97 J7.1 | 77.47,6.35 J4.1 | 77.47,13.97 J5.1 | 104.14,13.97 J11.1
  Top 0.203: 105.41,41.27 105.41,15.24 104.14,13.97 | SD1.5 102.23,42.55 104.14,42.55 105.41,41.27 | LED1.2 100.97,66.67 101.6,67.31 103.5,67.31 107.31,63.5 107.31,47.62 105.41,45.72 105.41,41.27
  Top 0.406: 123.19,15.24 123.19,10.16 | 123.19,10.16 123.19,6.35 | 59.69,13.97 59.69,6.35 | v53.34,12.7 52.07,12.7 | 95.25,13.97 95.25,11.43 | 95.25,11.43 95.25,8.89 | 95.25,6.35 95.25,8.89 | 86.36,13.97 86.36,11.43 87.63,10.16 | 86.36,6.35 86.36,8.89 85.09,10.16 | 68.58,13.97 68.58,12.7 71.12,10.16 | 68.58,6.35 68.58,8.89 69.85,10.16 71.12,10.16 | 77.47,13.97 77.47,11.43 78.74,10.16 | 77.47,6.35 77.47,8.89 76.2,10.16 | 78.74,10.16 76.2,10.16 | 76.2,10.16 71.12,10.16 | 78.74,10.16 85.09,10.16 | 85.09,10.16 87.63,10.16 | 87.63,10.16 93.98,10.16 95.25,11.43 | 102.23,9.53 95.89,9.53 95.25,8.89 | 102.23,9.53 102.87,9.53 104.14,10.79 104.14,13.97 | 104.14,6.35 104.14,7.62 102.23,9.53 | 123.19,10.16 123.83,10.79 136.53,10.79 137.16,11.43 | US5.P$2 137.14,15.22 137.16,15.24 | 137.16,12.7 137.79,13.34 149.21,13.34 US3.P$2
  Bottom 0.152: 59.69,6.35 J8.1 | 68.58,6.35 J6.1 | 104.14,13.97 J11.1 | OLED.P$1 52.01,33.34 50.9,32.23 50.9,15.14 v53.34,12.7
  Bottom 0.406: 68.58,6.35 66.67,8.26 63.5,8.26 61.59,6.35 59.69,6.35 v53.34,12.7 50.8,12.7 40.01,23.5 40.01,27.94 31.11,36.83 31.11,52.07 20.32,62.87 IMU_2.P$1 20.32,68.58 13.34,75.56 13.34,88.28 NAVBOARD_2.0.P$3 | 104.14,13.97 105.41,12.7 116.2,12.7 122.56,6.35 US4.P$2

### Text on the board
tNames: ENC_B | ENC_A | DIR | PWM | RST | 7V4 | GND | VCC | ESP / RX | ESP / TX | OFF | OFF | PWM | ANG | C | B | R | G | AD0 | SDA_SEL | SDA | SCL | GND | IMU1 | SDA | MEGA | 3V3 | SCL | SCL_SEL | GND | ESP | IMU2 | ESP07 | MOTORS | 3V3 | GND | ESP | MEGA | VCC | SCL_SEL | MISO | SDA_SEL | MOSI | SCK | SS | ULTRASONIC | 7V4 | VCC | GND | ANTENNA | SIG | NC | VCC | GND | NAVBOARD v1.0 | BUCK | © CSD Robocon NITK / All Rights Reserved